# EAGLE design schematic (EAGLE 7.6.0)
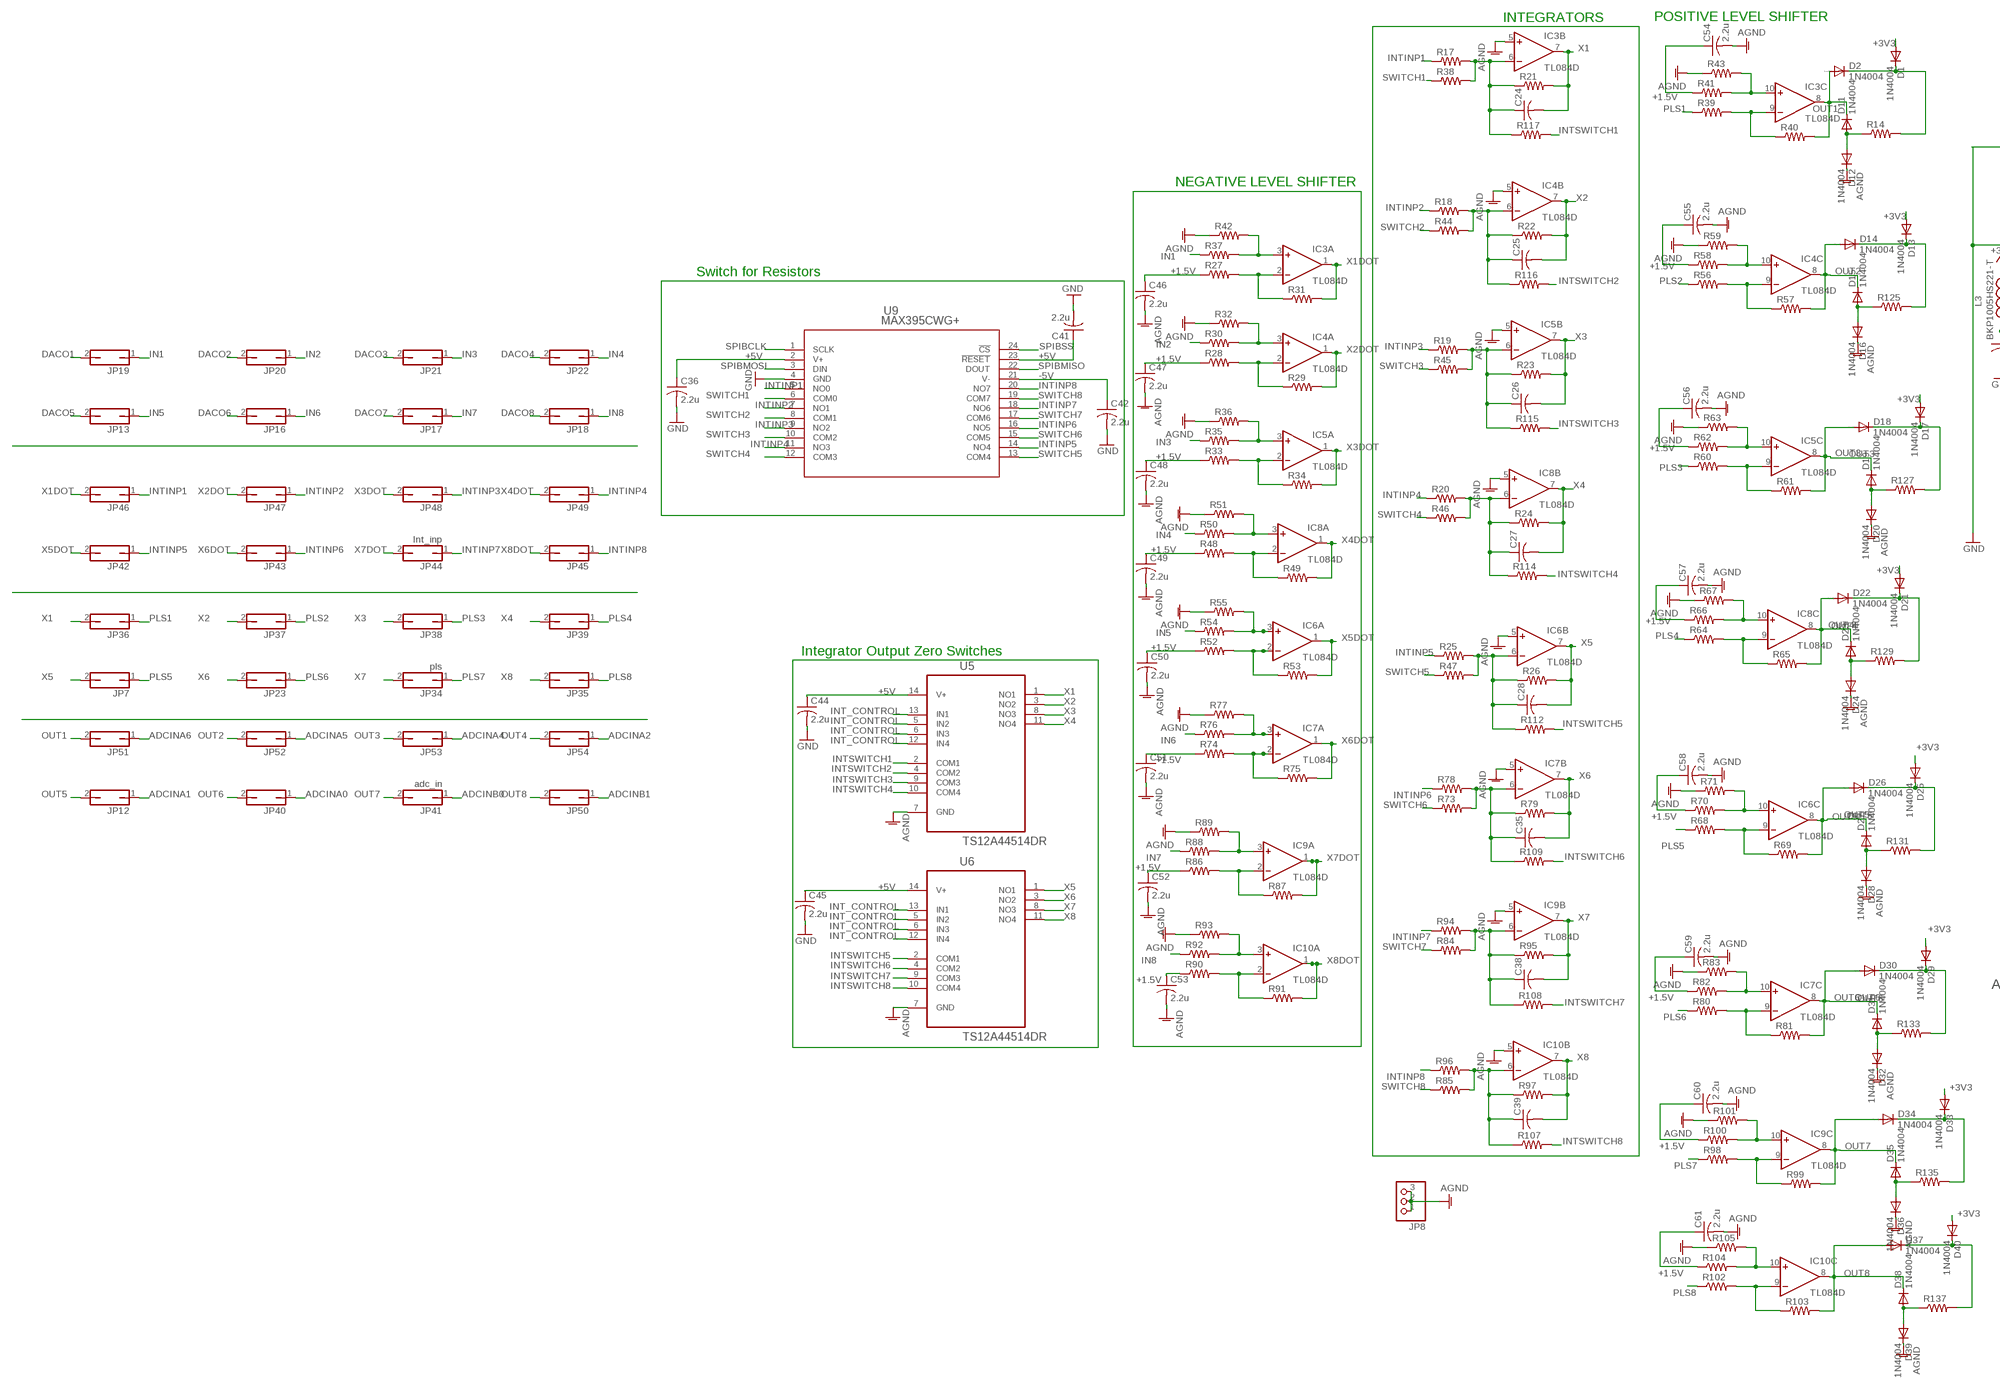
[diagram p0: schematic, sheet 1, part 1 of 2]
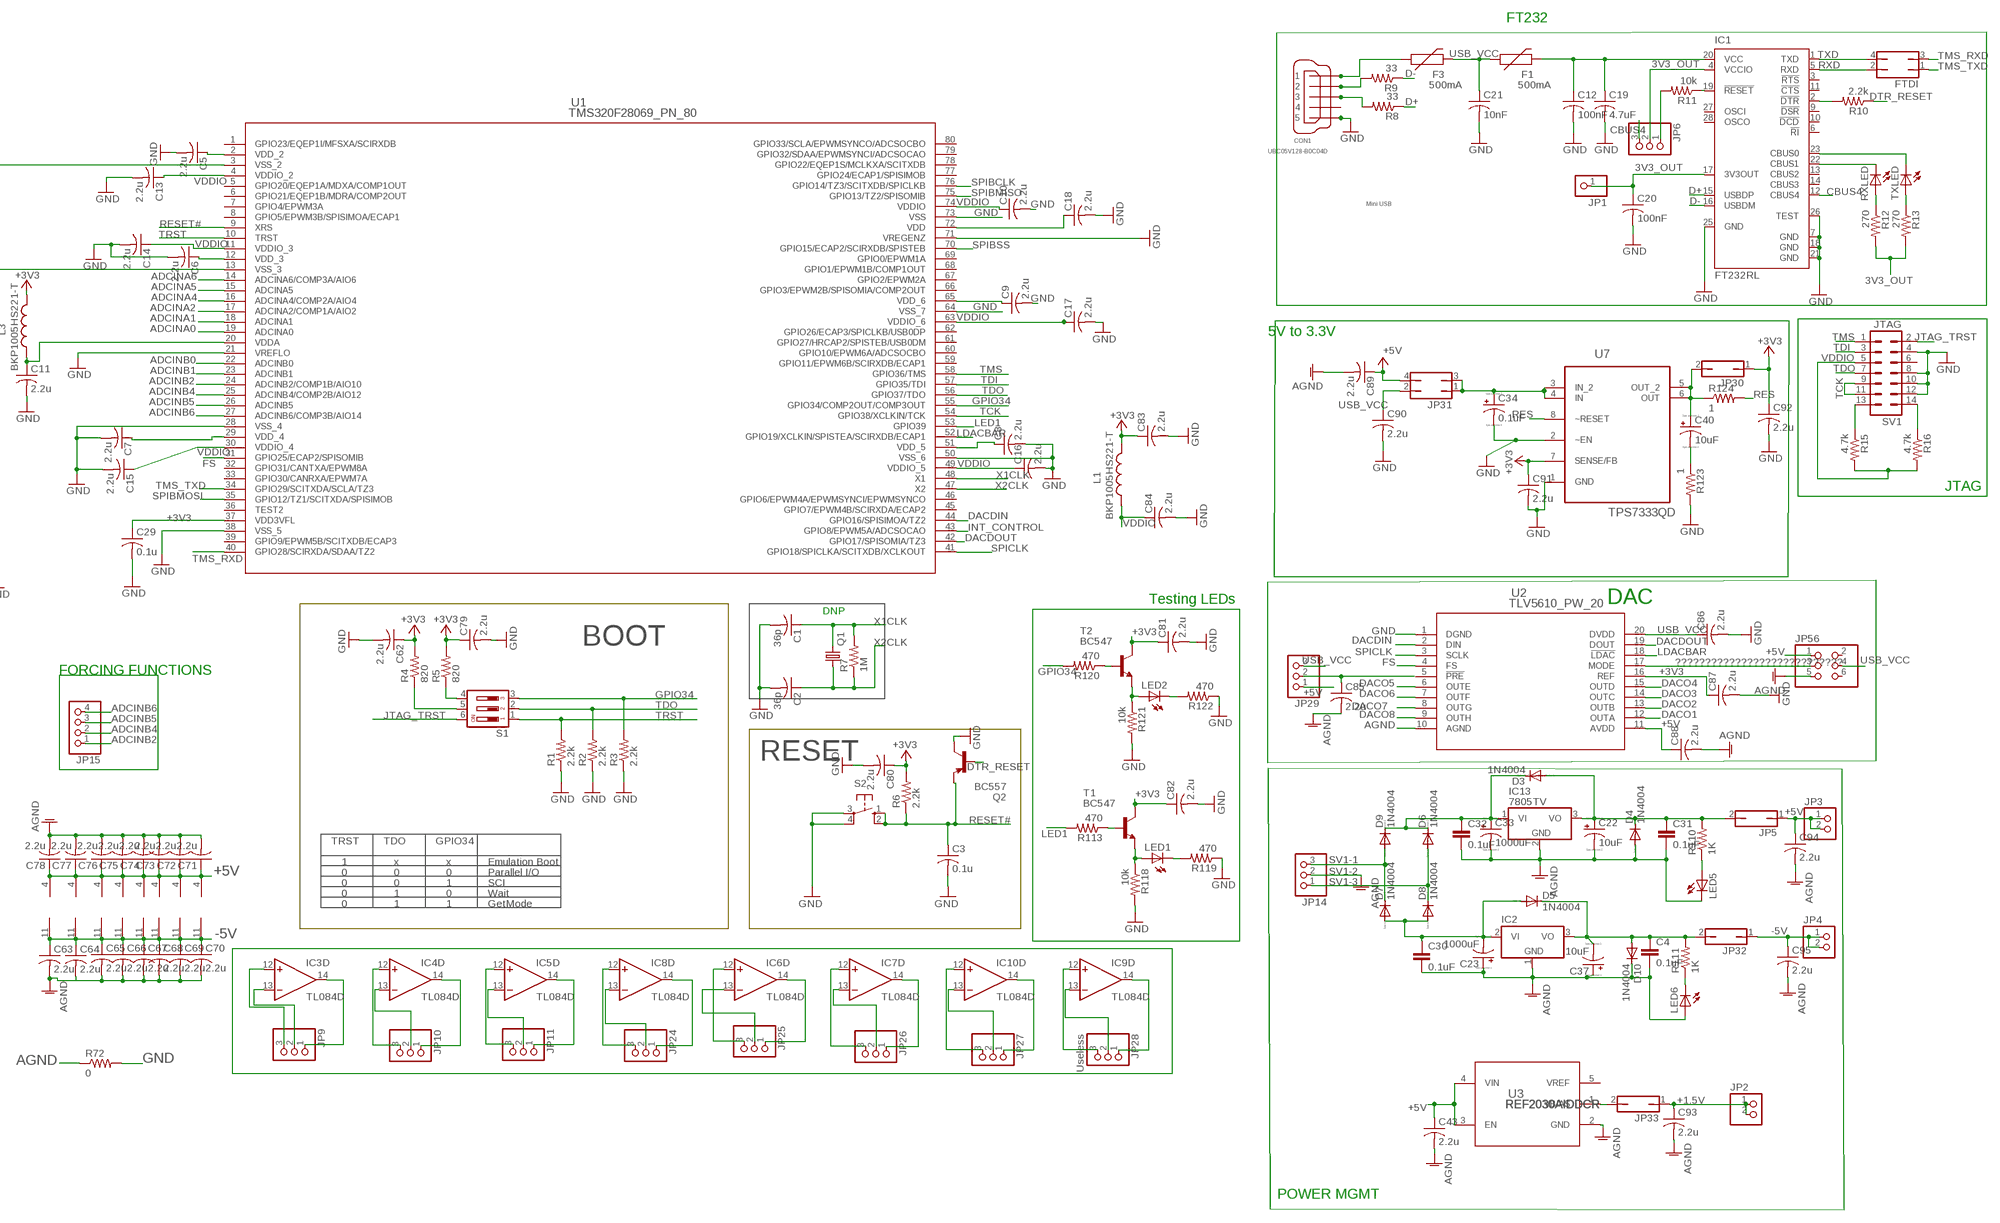
[diagram p1: schematic, sheet 1, part 2 of 2]

## Parts
C1  36p  C-USC1206  [C1206]
C2  36p  C-USC1206  [C1206]
C3  0.1u  C-USC1206  [C1206]
C4  0.1uF  C-EUC1206  [C1206]
C5  2.2u  C-USC1206  [C1206]
C6  2.2u  C-USC1206  [C1206]
C7  2.2u  C-USC1206  [C1206]
C8  2.2u  C-USC1206  [C1206]
C9  2.2u  C-USC1206  [C1206]
C10  2.2u  C-USC1206  [C1206]
C11  2.2u  C-USC1206  [C1206]
C12  100nF  C-USC1206  [C1206]
C13  2.2u  C-USC1206  [C1206]
C14  2.2u  C-USC1206  [C1206]
C15  2.2u  C-USC1206  [C1206]
C16  2.2u  C-USC1206  [C1206]
C17  2.2u  C-USC1206  [C1206]
C18  2.2u  C-USC1206  [C1206]
C19  4.7uF  C-USC1206  [C1206]
C20  100nF  C-USC1206  [C1206]
C21  10nF  C-USC1206  [C1206]
C22  10uF  CPOL-USE2.5-7  [E2,5-7]
C23  1000uF  CPOL-USE2.5-7  [E2,5-7]
C24  C-USC1206  [C1206]
C25  C-USC1206  [C1206]
C26  C-USC1206  [C1206]
C27  C-USC1206  [C1206]
C28  C-USC1206  [C1206]
C29  0.1u  C-USC1206  [C1206]
C30  0.1uF  C-EUC1206  [C1206]
C31  0.1uF  C-EUC1206  [C1206]
C32  0.1uF  C-EUC1206  [C1206]
C33  1000uF  CPOL-USE2.5-7  [E2,5-7]
C34  0.1uF  CPOL-USE2.5-7  [E2,5-7]
C35  C-USC1206  [C1206]
C36  2.2u  C-USC1206  [C1206]
C37  10uF  CPOL-USE2.5-7  [E2,5-7]
C38  C-USC1206  [C1206]
C39  C-USC1206  [C1206]
C40  10uF  CPOL-USE2.5-7  [E2,5-7]
C41  2.2u  C-USC1206  [C1206]
C42  2.2u  C-USC1206  [C1206]
C43  2.2u  C-USC1206  [C1206]
C44  2.2u  C-USC1206  [C1206]
C45  2.2u  C-USC1206  [C1206]
C46  2.2u  C-USC1206  [C1206]
C47  2.2u  C-USC1206  [C1206]
C48  2.2u  C-USC1206  [C1206]
C49  2.2u  C-USC1206  [C1206]
C50  2.2u  C-USC1206  [C1206]
C51  2.2u  C-USC1206  [C1206]
C52  2.2u  C-USC1206  [C1206]
C53  2.2u  C-USC1206  [C1206]
C54  2.2u  C-USC1206  [C1206]
C55  2.2u  C-USC1206  [C1206]
C56  2.2u  C-USC1206  [C1206]
C57  2.2u  C-USC1206  [C1206]
C58  2.2u  C-USC1206  [C1206]
C59  2.2u  C-USC1206  [C1206]
C60  2.2u  C-USC1206  [C1206]
C61  2.2u  C-USC1206  [C1206]
C62  2.2u  C-USC1206  [C1206]
C63  2.2u  C-USC1206  [C1206]
C64  2.2u  C-USC1206  [C1206]
C65  2.2u  C-USC1206  [C1206]
C66  2.2u  C-USC1206  [C1206]
C67  2.2u  C-USC1206  [C1206]
C68  2.2u  C-USC1206  [C1206]
C69  2.2u  C-USC1206  [C1206]
C70  2.2u  C-USC1206  [C1206]
C71  2.2u  C-USC1206  [C1206]
C72  2.2u  C-USC1206  [C1206]
C73  2.2u  C-USC1206  [C1206]
C74  2.2u  C-USC1206  [C1206]
C75  2.2u  C-USC1206  [C1206]
C76  2.2u  C-USC1206  [C1206]
C77  2.2u  C-USC1206  [C1206]
C78  2.2u  C-USC1206  [C1206]
C79  2.2u  C-USC1206  [C1206]
C80  2.2u  C-USC1206  [C1206]
C81  2.2u  C-USC1206  [C1206]
C82  2.2u  C-USC1206  [C1206]
C83  2.2u  C-USC1206  [C1206]
C84  2.2u  C-USC1206  [C1206]
C85  2.2u  C-USC1206  [C1206]
C86  2.2u  C-USC1206  [C1206]
C87  2.2u  C-USC1206  [C1206]
C88  2.2u  C-USC1206  [C1206]
C89  2.2u  C-USC1206  [C1206]
C90  2.2u  C-USC1206  [C1206]
C91  2.2u  C-USC1206  [C1206]
C92  2.2u  C-USC1206  [C1206]
C93  2.2u  C-USC1206  [C1206]
C94  2.2u  C-USC1206  [C1206]
C95  2.2u  C-USC1206  [C1206]
CON1  UBC05V128-B0C04D  MINI-USB-32005-201  [32005-201]
D1  1N4004  [DO41-10]
D2  1N4004  [DO41-10]
D3  1N4004  [DO41-10]
D4  1N4004  [DO41-10]
D5  1N4004  [DO41-10]
D6  1N4004  [DO41-10]
D7  1N4004  [DO41-10]
D8  1N4004  [DO41-10]
D9  1N4004  [DO41-10]
D10  1N4004  [DO41-10]
D11  1N4004  [DO41-10]
D12  1N4004  [DO41-10]
D13  1N4004  [DO41-10]
D14  1N4004  [DO41-10]
D15  1N4004  [DO41-10]
D16  1N4004  [DO41-10]
D17  1N4004  [DO41-10]
D18  1N4004  [DO41-10]
D19  1N4004  [DO41-10]
D20  1N4004  [DO41-10]
D21  1N4004  [DO41-10]
D22  1N4004  [DO41-10]
D23  1N4004  [DO41-10]
D24  1N4004  [DO41-10]
D25  1N4004  [DO41-10]
D26  1N4004  [DO41-10]
D27  1N4004  [DO41-10]
D28  1N4004  [DO41-10]
D29  1N4004  [DO41-10]
D30  1N4004  [DO41-10]
D31  1N4004  [DO41-10]
D32  1N4004  [DO41-10]
D33  1N4004  [DO41-10]
D34  1N4004  [DO41-10]
D35  1N4004  [DO41-10]
D36  1N4004  [DO41-10]
D37  1N4004  [DO41-10]
D38  1N4004  [DO41-10]
D39  1N4004  [DO41-10]
D40  1N4004  [DO41-10]
F1  500mA  PTC0603  [0603]
F3  500mA  PTC0603  [0603]
FTDI  JP2Q  [JP2Q]
IC1  FT232RL  [SSOP28]
IC2  7905T  [TO220H]
IC3  TL084D  [SO14]
IC4  TL084D  [SO14]
IC5  TL084D  [SO14]
IC6  TL084D  [SO14]
IC7  TL084D  [SO14]
IC8  TL084D  [SO14]
IC9  TL084D  [SO14]
IC10  TL084D  [SO14]
IC13  7805TV  [TO220V]
JP1  PINHD-1X1  [1X01]
JP2  PINHD-1X2  [1X02]
JP3  PINHD-1X2  [1X02]
JP4  PINHD-1X2  [1X02]
JP5  JP1Q  [JP1]
JP6  PINHD-1X3  [1X03]
JP7  JP1Q  [JP1]
JP8  PINHD-1X3  [1X03]
JP9  PINHD-1X3  [1X03]
JP10  PINHD-1X3  [1X03]
JP11  PINHD-1X3  [1X03]
JP12  JP1Q  [JP1]
JP13  JP1Q  [JP1]
JP14  PINHD-1X3  [1X03]
JP15  PINHD-1X4  [1X04]
JP16  JP1Q  [JP1]
JP17  JP1Q  [JP1]
JP18  JP1Q  [JP1]
JP19  JP1Q  [JP1]
JP20  JP1Q  [JP1]
JP21  JP1Q  [JP1]
JP22  JP1Q  [JP1]
JP23  JP1Q  [JP1]
JP24  PINHD-1X3  [1X03]
JP25  PINHD-1X3  [1X03]
JP26  PINHD-1X3  [1X03]
JP27  PINHD-1X3  [1X03]
JP28  Useless  PINHD-1X3  [1X03]
JP29  PINHD-1X3  [1X03]
JP30  JP1Q  [JP1]
JP31  JP2Q  [JP2Q]
JP32  JP1Q  [JP1]
JP33  JP1Q  [JP1]
JP34  pls  JP1Q  [JP1]
JP35  JP1Q  [JP1]
JP36  JP1Q  [JP1]
JP37  JP1Q  [JP1]
JP38  JP1Q  [JP1]
JP39  JP1Q  [JP1]
JP40  JP1Q  [JP1]
JP41  adc_in  JP1Q  [JP1]
JP42  JP1Q  [JP1]
JP43  JP1Q  [JP1]
JP44  Int_inp  JP1Q  [JP1]
JP45  JP1Q  [JP1]
JP46  JP1Q  [JP1]
JP47  JP1Q  [JP1]
JP48  JP1Q  [JP1]
JP49  JP1Q  [JP1]
JP50  JP1Q  [JP1]
JP51  JP1Q  [JP1]
JP52  JP1Q  [JP1]
JP53  JP1Q  [JP1]
JP54  JP1Q  [JP1]
JP56  PINHD-2X3  [2X03]
L1  BKP1005HS221-T  L-US0204/5  [0204/5]
L3  BKP1005HS221-T  L-US0204/5  [0204/5]
LED1  LED3MM  [LED3MM]
LED2  LED3MM  [LED3MM]
LED5  LED3MM  [LED3MM]
LED6  LED3MM  [LED3MM]
Q1  CRYSTALHC49S  [HC49/S]
Q2  BC557  [TO92-EBC]
R1  2.2k  R-US_R1206  [R1206]
R2  2.2k  R-US_R1206  [R1206]
R3  2.2k  R-US_R1206  [R1206]
R4  820  R-US_R1206  [R1206]
R5  820  R-US_R1206  [R1206]
R6  2.2k  R-US_R1206  [R1206]
R7  1M  R-US_R1206  [R1206]
R8  33  R-US_R1206  [R1206]
R9  33  R-US_R1206  [R1206]
R10  2.2k  R-US_R1206  [R1206]
R11  10k  R-US_R1206  [R1206]
R12  270  R-US_R1206  [R1206]
R13  270  R-US_R1206  [R1206]
R14  R-US_R1206  [R1206]
R15  4.7k  R-US_M1206  [M1206]
R16  4.7k  R-US_M1206  [M1206]
R17  R-US_R1206  [R1206]
R18  R-US_R1206  [R1206]
R19  R-US_R1206  [R1206]
R20  R-US_R1206  [R1206]
R21  R-US_R1206  [R1206]
R22  R-US_R1206  [R1206]
R23  R-US_R1206  [R1206]
R24  R-US_R1206  [R1206]
R25  R-US_R1206  [R1206]
R26  R-US_R1206  [R1206]
R27  R-US_R1206  [R1206]
R28  R-US_R1206  [R1206]
R29  R-US_R1206  [R1206]
R30  R-US_R1206  [R1206]
R31  R-US_R1206  [R1206]
R32  R-US_R1206  [R1206]
R33  R-US_R1206  [R1206]
R34  R-US_R1206  [R1206]
R35  R-US_R1206  [R1206]
R36  R-US_R1206  [R1206]
R37  R-US_R1206  [R1206]
R38  R-US_R1206  [R1206]
R39  R-US_R1206  [R1206]
R40  R-US_R1206  [R1206]
R41  R-US_R1206  [R1206]
R42  R-US_R1206  [R1206]
R43  R-US_R1206  [R1206]
R44  R-US_R1206  [R1206]
R45  R-US_R1206  [R1206]
R46  R-US_R1206  [R1206]
R47  R-US_R1206  [R1206]
R48  R-US_R1206  [R1206]
R49  R-US_R1206  [R1206]
R50  R-US_R1206  [R1206]
R51  R-US_R1206  [R1206]
R52  R-US_R1206  [R1206]
R53  R-US_R1206  [R1206]
R54  R-US_R1206  [R1206]
R55  R-US_R1206  [R1206]
R56  R-US_R1206  [R1206]
R57  R-US_R1206  [R1206]
R58  R-US_R1206  [R1206]
R59  R-US_R1206  [R1206]
R60  R-US_R1206  [R1206]
R61  R-US_R1206  [R1206]
R62  R-US_R1206  [R1206]
R63  R-US_R1206  [R1206]
R64  R-US_R1206  [R1206]
R65  R-US_R1206  [R1206]
R66  R-US_R1206  [R1206]
R67  R-US_R1206  [R1206]
R68  R-US_R1206  [R1206]
R69  R-US_R1206  [R1206]
R70  R-US_R1206  [R1206]
R71  R-US_R1206  [R1206]
R72  0  R-US_R1206  [R1206]
R73  R-US_R1206  [R1206]
R74  R-US_R1206  [R1206]
R75  R-US_R1206  [R1206]
R76  R-US_R1206  [R1206]
R77  R-US_R1206  [R1206]
R78  R-US_R1206  [R1206]
R79  R-US_R1206  [R1206]
R80  R-US_R1206  [R1206]
R81  R-US_R1206  [R1206]
R82  R-US_R1206  [R1206]
R83  R-US_R1206  [R1206]
R84  R-US_R1206  [R1206]
R85  R-US_R1206  [R1206]
R86  R-US_R1206  [R1206]
R87  R-US_R1206  [R1206]
R88  R-US_R1206  [R1206]
R89  R-US_R1206  [R1206]
R90  R-US_R1206  [R1206]
R91  R-US_R1206  [R1206]
R92  R-US_R1206  [R1206]
R93  R-US_R1206  [R1206]
R94  R-US_R1206  [R1206]
R95  R-US_R1206  [R1206]
R96  R-US_R1206  [R1206]
R97  R-US_R1206  [R1206]
R98  R-US_R1206  [R1206]
R99  R-US_R1206  [R1206]
R100  R-US_R1206  [R1206]
R101  R-US_R1206  [R1206]
R102  R-US_R1206  [R1206]
R103  R-US_R1206  [R1206]
R104  R-US_R1206  [R1206]
R105  R-US_R1206  [R1206]
R107  R-US_R1206  [R1206]
R108  R-US_R1206  [R1206]
R109  R-US_R1206  [R1206]
R110  1K  R-US_0207/10  [0207/10]
R111  1K  R-US_0207/10  [0207/10]
R112  R-US_R1206  [R1206]
R113  470  R-US_R1206  [R1206]
R114  R-US_R1206  [R1206]
R115  R-US_R1206  [R1206]
R116  R-US_R1206  [R1206]
R117  R-US_R1206  [R1206]
R118  10k  R-US_R1206  [R1206]
R119  470  R-US_R1206  [R1206]
R120  470  R-US_R1206  [R1206]
R121  10k  R-US_R1206  [R1206]
R122  470  R-US_R1206  [R1206]
R123  1  R-US_M1206  [M1206]
R124  1  R-US_M1206  [M1206]
R125  R-US_R1206  [R1206]
R127  R-US_R1206  [R1206]
R129  R-US_R1206  [R1206]
R131  R-US_R1206  [R1206]
R133  R-US_R1206  [R1206]
R135  R-US_R1206  [R1206]
R137  R-US_R1206  [R1206]
RXLED  LEDCHIPLED_1206  [CHIPLED_1206]
S1  DIP03YL  [DIP03YL]
S2  10-XX  [B3F-10XX]
SV1  JTAG  MA07-2  [MA07-2]
T1  BC547  [TO92]
T2  BC547  [TO92]
TXLED  LEDCHIPLED_1206  [CHIPLED_1206]
U1  TMS320F28069_PN_80  [PN80]
U2  TLV5610_PW_20  [PW20]
U3  REF2030AIDDCR  [DDC0005A_N]
U5  TS12A44514DR  [SOIC127P600X175-14N]
U6  TS12A44514DR  [SOIC127P600X175-14N]
U7  TPS7333QD  [SOIC127P600X175-8N]
U9  MAX395CWG+  [21-0042B_24]

## Nets
3V3_OUT: C20.1 IC1.4(VCCIO) IC1.17(3V3OUT) JP1.1 JP6.2 R12.2 R13.2
+1.5V: C46.1 C47.1 C48.1 C49.1 C50.1 C51.1 C52.1 C53.1 C54.1 C55.1 C56.1 C57.1 C58.1 C59.1 C60.1 C61.1 C93.1 JP2.1 JP2.2 JP33.1 R27.1 R28.1 R33.1 R41.1 R48.1 R52.1 R58.1 R62.1 R66.1 R70.1 R74.1 R82.1 R86.1 R90.1 R100.1 R104.1
+3V3: C29.1 C62.1 C79.1 C80.1 C81.1 C82.1 C83.1 C87.1 C91.1 C92.1 D1.A D13.A D17.A D21.A D25.A D29.A D33.A D40.A JP30.1 L1.2 L3.2 R4.2 R5.2 R6.2 T1.3(C) T2.3(C) U1.37(VDD3VFL) U2.16(REF) U7.7(SENSE/FB)
+5V: C36.1 C41.1 C43.1 C44.1 C45.1 C71.1 C72.1 C73.1 C74.1 C75.1 C76.1 C77.1 C78.1 C88.1 C89.1 C94.1 IC3.4(P:V+) IC4.4(P:V+) IC5.4(P:V+) IC6.4(P:V+) IC7.4(P:V+) IC8.4(P:V+) IC9.4(P:V+) IC10.4(P:V+) JP3.1 JP3.2 JP5.1 JP29.1 JP31.4 JP56.1 U2.11(AVDD) U3.3(EN) U3.4(VIN) U5.14(V+) U6.14(V+) U9.2(V+) U9.23(!RESET) ; supply symbol labelled +3V3
-5V: C42.1 C63.1 C64.1 C65.1 C66.1 C67.1 C68.1 C69.1 C70.1 C95.1 IC3.11(P:V-) IC4.11(P:V-) IC5.11(P:V-) IC6.11(P:V-) IC7.11(P:V-) IC8.11(P:V-) IC9.11(P:V-) IC10.11(P:V-) JP4.1 JP4.2 JP32.1 U9.21(V-)
????????????????????????????: JP56.3 U2.17(MODE)
ADCINA0: JP40.1 U1.19(ADCINA0)
ADCINA1: JP12.1 U1.18(ADCINA1)
ADCINA2: JP54.1 U1.17(ADCINA2/COMP1A/AIO2)
ADCINA4: JP53.1 U1.16(ADCINA4/COMP2A/AIO4)
ADCINA5: JP52.1 U1.15(ADCINA5)
ADCINA6: JP51.1 U1.14(ADCINA6/COMP3A/AIO6)
ADCINB0: JP41.1 U1.22(ADCINB0)
ADCINB1: JP50.1 U1.23(ADCINB1)
ADCINB2: JP15.1 U1.24(ADCINB2/COMP1B/AIO10)
ADCINB4: JP15.2 U1.25(ADCINB4/COMP2B/AIO12)
ADCINB5: JP15.3 U1.26(ADCINB5)
ADCINB6: JP15.4 U1.27(ADCINB6/COMP3B/AIO14)
AGND: C4.2 C22.- C23.+ C30.2 C31.2 C32.2 C33.- C37.+ C43.2 C46.2 C47.2 C48.2 C49.2 C50.2 C51.2 C52.2 C53.2 C54.2 C55.2 C56.2 C57.2 C58.2 C59.2 C60.2 C61.2 C63.2 C64.2 C65.2 C66.2 C67.2 C68.2 C69.2 C70.2 C71.2 C72.2 C73.2 C74.2 C75.2 C76.2 C77.2 C78.2 C85.2 C88.2 C89.2 C93.2 C94.2 C95.2 D4.A D10.C D12.C D16.C D20.C D24.C D28.C D32.C D36.C D39.C IC2.1(GND) IC3.5(B:+IN) IC4.5(B:+IN) IC5.5(B:+IN) IC6.5(B:+IN) IC7.5(B:+IN) IC8.5(B:+IN) IC9.5(B:+IN) IC10.5(B:+IN) IC13.2(GND) JP8.1 JP8.2 JP8.3 JP56.5 LED5.K(C) LED6.A R32.1 R36.1 R42.1 R43.1 R51.1 R55.1 R59.1 R63.1 R67.1 R71.1 R72.1 R77.1 R83.1 R89.1 R93.1 R101.1 R105.1 U2.10(AGND) U3.2(GND) U5.7(GND) U6.7(GND)
CBUS4: IC1.12(CBUS4) JP6.3
D+: IC1.15(USBDP) R8.1
D-: IC1.16(USBDM) R9.1
DACDIN: U1.44(GPIO16/SPISIMOA/TZ2) U2.2(DIN)
DACDOUT: U1.42(GPIO17/SPISOMIA/TZ3) U2.19(DOUT)
DACO1: JP19.2 U2.12(OUTA)
DACO2: JP20.2 U2.13(OUTB)
DACO3: JP21.2 U2.14(OUTC)
DACO4: JP22.2 U2.15(OUTD)
DACO5: JP13.2 U2.6(OUTE)
DACO6: JP16.2 U2.7(OUTF)
DACO7: JP17.2 U2.8(OUTG)
DACO8: JP18.2 U2.9(OUTH)
DTR_RESET: Q2.B R10.1
FS: U1.31(GPIO25/ECAP2/SPISOMIB) U2.4(FS)
GND: C1.2 C2.2 C3.2 C5.2 C6.2 C7.2 C8.2 C9.2 C10.2 C11.2 C12.2 C13.2 C14.2 C15.2 C16.2 C17.2 C18.2 C19.2 C20.2 C21.2 C29.2 C34.- C36.2 C41.2 C42.2 C44.2 C45.2 C62.2 C79.2 C80.2 C81.2 C82.2 C83.2 C84.2 C86.2 C87.2 C90.2 C91.2 C92.2 CON1.5 IC1.7(GND) IC1.18(GND) IC1.21(GND) IC1.25(GND) IC1.26(TEST) Q2.C R1.1 R2.1 R3.1 R72.2 R118.2 R119.1 R121.2 R122.1 R123.2 S2.3(P) S2.4(P1) SV1.4 SV1.8 SV1.10 SV1.12 U1.3(VSS_2) U1.13(VSS_3) U1.21(VREFLO) U1.28(VSS_4) U1.38(VSS_5) U1.50(VSS_6) U1.64(VSS_7) U1.71(VREGENZ) U1.73(VSS) U2.1(DGND) U7.1(GND) U7.2(~EN) U9.4(GND)
GPIO34: R3.2 R120.2 S1.3 U1.55(GPIO34/COMP2OUT/COMP3OUT)
IDK: C22.+ C31.1 D3.A D4.C IC13.3(VO) JP5.2 R110.2
IDK2: C4.1 C37.- D5.C D10.A IC2.3(VO) JP32.2 R111.2
IN1: JP19.1 R37.1
IN2: JP20.1 R30.1
IN3: JP21.1 R35.1
IN4: JP22.1 R50.1
IN5: JP13.1 R54.1
IN6: JP16.1 R76.1
IN7: JP17.1 R88.1
IN8: JP18.1 R92.1
INT_CONTROL: U1.43(GPIO8/EPWM5A/ADCSOCAO) U5.5(IN2) U5.6(IN3) U5.12(IN4) U5.13(IN1) U6.5(IN2) U6.6(IN3) U6.12(IN4) U6.13(IN1)
INTINP1: JP46.1 R17.1 U9.5(NO0)
INTINP2: JP47.1 R18.1 U9.7(NO1)
INTINP3: JP48.1 R19.1 U9.9(NO2)
INTINP4: JP49.1 R20.1 U9.11(NO3)
INTINP5: JP42.1 R25.1 U9.14(NO4)
INTINP6: JP43.1 R78.1 U9.16(NO5)
INTINP7: JP44.1 R94.1 U9.18(NO6)
INTINP8: JP45.1 R96.1 U9.20(NO7)
INTSWITCH1: R117.2 U5.2(COM1)
INTSWITCH2: R116.2 U5.4(COM2)
INTSWITCH3: R115.2 U5.9(COM3)
INTSWITCH4: R114.2 U5.10(COM4)
INTSWITCH5: R112.2 U6.2(COM1)
INTSWITCH6: R109.2 U6.4(COM2)
INTSWITCH7: R108.2 U6.9(COM3)
INTSWITCH8: R107.2 U6.10(COM4)
JTAG_TRST: S1.6 SV1.2
LDACBAR: U1.52(GPIO19/XCLKIN/SPISTEA/SCIRXDB/ECAP1) U2.18(!LDAC)
LED1: R113.2 U1.53(GPIO39)
N$1: C5.1 U1.2(VDD_2)
N$2: C6.1 U1.12(VDD_3)
N$3: C7.1 U1.29(VDD_4)
N$4: C8.1 U1.51(VDD_5)
N$5: C9.1 U1.65(VDD_6)
N$6: IC1.2(!DTR) R10.2
N$7: C11.1 L3.1 U1.20(VDDA)
N$8: C18.1 U1.72(VDD)
N$9: R5.1 S1.4
N$10: R4.1 S1.5
N$11: CON1.2 R9.2
N$12: CON1.3 R8.2
N$13: IC1.19(!RESET) R11.1
N$14: IC1.22(CBUS1) RXLED.C
N$15: IC1.23(CBUS0) TXLED.C
N$16: R12.1 RXLED.A
N$17: R13.1 TXLED.A
N$20: C25.1 IC4.6(B:-IN) R18.2 R22.1 R44.2 R116.1
N$21: C26.1 IC5.6(B:-IN) R19.2 R23.1 R45.2 R115.1
N$22: C27.1 IC8.6(B:-IN) R20.2 R24.1 R46.2 R114.1
N$23: IC4.2(A:-IN) R28.2 R29.1
N$24: R15.1 SV1.13
N$25: R16.1 SV1.14
N$26: IC4.3(A:+IN) R30.2 R32.2
N$28: C24.1 IC3.6(B:-IN) R17.2 R21.1 R38.2 R117.1
N$29: IC3.2(A:-IN) R27.2 R31.1
N$30: C28.1 IC6.6(B:-IN) R25.2 R26.1 R47.2 R112.1
N$31: IC5.2(A:-IN) R33.2 R34.1
N$33: IC3.3(A:+IN) R37.2 R42.2
N$35: IC5.3(A:+IN) R35.2 R36.2
N$36: IC3.9(C:-IN) R39.2 R40.1
N$38: IC3.10(C:+IN) R41.2 R43.2
N$39: IC8.2(A:-IN) R48.2 R49.1
N$40: IC8.3(A:+IN) R50.2 R51.2
N$41: IC7.2(A:-IN) R74.2 R75.1
N$42: IC6.2(A:-IN) R52.2 R53.1
N$43: D19.A D20.A R127.1
N$44: IC6.3(A:+IN) R54.2 R55.2
N$45: IC7.3(A:+IN) R76.2 R77.2
N$46: IC8.12(D:+IN) JP24.3
N$47: IC4.9(C:-IN) R56.2 R57.1
N$48: IC4.10(C:+IN) R58.2 R59.2
N$49: IC5.9(C:-IN) R60.2 R61.1
N$50: IC5.10(C:+IN) R62.2 R63.2
N$51: IC8.9(C:-IN) R64.2 R65.1
N$52: IC8.10(C:+IN) R66.2 R67.2
N$53: IC6.9(C:-IN) R68.2 R69.1
N$54: IC6.10(C:+IN) R70.2 R71.2
N$55: C35.1 IC7.6(B:-IN) R73.2 R78.2 R79.1 R109.1
N$56: IC7.9(C:-IN) R80.2 R81.1
N$57: IC7.10(C:+IN) R82.2 R83.2
N$58: IC9.2(A:-IN) R86.2 R87.1
N$59: IC9.3(A:+IN) R88.2 R89.2
N$60: IC10.2(A:-IN) R90.2 R91.1
N$61: IC10.3(A:+IN) R92.2 R93.2
N$62: C38.1 IC9.6(B:-IN) R84.2 R94.2 R95.1 R108.1
N$63: C39.1 IC10.6(B:-IN) R85.2 R96.2 R97.1 R107.1
N$64: IC9.9(C:-IN) R98.2 R99.1
N$65: IC9.10(C:+IN) R100.2 R101.2
N$66: IC10.9(C:-IN) R102.2 R103.1
N$67: IC10.10(C:+IN) R104.2 R105.2
N$70: IC8.13(D:-IN) JP24.2
N$71: IC10.12(D:+IN) JP27.3
N$72: IC7.14(D:OUT) JP26.1
N$73: C32.1 C33.+ D3.C D6.C D9.C IC13.1(VI)
N$74: IC7.12(D:+IN) JP26.3
N$75: IC10.14(D:OUT) JP27.1
N$76: IC9.12(D:+IN) JP28.3
N$77: C40.+ JP30.2 R124.1 U7.5(OUT_2) U7.6(OUT)
N$78: C40.- R123.1
N$80: LED6.K(C) R111.1
N$81: C34.+ JP31.1 JP31.3 U7.3(IN_2) U7.4(IN)
N$82: LED5.A R110.1
N$83: CON1.1 F3.1
N$85: IC8.14(D:OUT) JP24.1
N$86: C23.- C30.1 D5.A D7.A D8.A IC2.2(VI)
N$87: IC6.13(D:-IN) JP25.2
N$88: IC6.12(D:+IN) JP25.3
N$89: IC6.14(D:OUT) JP25.1
N$90: IC7.13(D:-IN) JP26.2
N$91: JP33.2 U3.1(VBIAS)
N$93: IC10.13(D:-IN) JP27.2
N$95: JP6.1 R11.2
N$96: IC9.13(D:-IN) JP28.2
N$97: D11.A D12.A R14.1
N$98: IC9.14(D:OUT) JP28.1
N$100: D15.A D16.A R125.1
N$102: R113.1 T1.2(B)
N$104: LED1.A R118.1 T1.1(E)
N$105: LED1.K(C) R119.2
N$106: R120.1 T2.2(B)
N$107: LED2.A R121.1 T2.1(E)
N$108: LED2.K(C) R122.2
N$109: IC3.13(D:-IN) JP9.2
N$110: IC3.12(D:+IN) JP9.3
N$111: IC3.14(D:OUT) JP9.1
N$112: IC4.13(D:-IN) JP10.2
N$113: IC4.12(D:+IN) JP10.3
N$114: IC4.14(D:OUT) JP10.1
N$115: IC5.12(D:+IN) JP11.3
N$116: IC5.13(D:-IN) JP11.2
N$117: IC5.14(D:OUT) JP11.1
N$118: D1.C D2.C R14.2
N$119: D13.C D14.C R125.2
N$120: D17.C D18.C R127.2
N$121: D23.A D24.A R129.1
N$122: D21.C D22.C R129.2
N$123: D27.A D28.A R131.1
N$124: D25.C D26.C R131.2
N$125: D31.A D32.A R133.1
N$126: D29.C D30.C R133.2
N$127: D35.A D36.A R135.1
N$128: D33.C D34.C R135.2
N$129: D38.A D39.A R137.1
N$130: D37.C R137.2
N$133: C85.1 JP29.2
OUT1: D2.A D11.C IC3.8(C:OUT) JP51.2 R40.2
OUT2: D14.A D15.C IC4.8(C:OUT) JP52.2 R57.2
OUT3: D18.A D19.C IC5.8(C:OUT) JP53.2 R61.2
OUT4: D22.A D23.C IC8.8(C:OUT) JP54.2 R65.2
OUT5: D26.A D27.C IC6.8(C:OUT) JP12.2 R69.2
OUT6: D30.A D31.C IC7.8(C:OUT) JP40.2 R81.2
OUT7: D34.A D35.C IC9.8(C:OUT) JP41.2 R99.2
OUT8: D37.A D38.C IC10.8(C:OUT) JP50.2 R103.2
PLS1: JP36.1 R39.1
PLS2: JP37.1 R56.1
PLS3: JP38.1 R60.1
PLS4: JP39.1 R64.1
PLS5: JP7.1 R68.1
PLS6: JP23.1 R80.1
PLS7: JP34.1 R98.1
PLS8: JP35.1 R102.1
RES: R124.2 U7.8(~RESET)
RESET#: C3.1 Q2.E R6.1 S2.1(S) S2.2(S1) U1.9(XRS)
RXD: FTDI.2 IC1.5(RXD)
SPIBCLK: U1.76(GPIO14/TZ3/SCITXDB/SPICLKB) U9.1(SCLK)
SPIBMISO: U1.75(GPIO13/TZ2/SPISOMIB) U9.22(DOUT)
SPIBMOSI: U1.35(GPIO12/TZ1/SCITXDA/SPISIMOB) U9.3(DIN)
SPIBSS: U1.70(GPIO15/ECAP2/SCIRXDB/SPISTEB) U9.24(!CS)
SPICLK: U1.41(GPIO18/SPICLKA/SCITXDB/XCLKOUT) U2.3(SCLK)
SV1-1: D7.C D9.A JP14.3
SV1-2: JP14.2 ; supply symbol labelled AGND
SV1-3: D6.A D8.C JP14.1
SWITCH1: R38.1 U9.6(COM0)
SWITCH2: R44.1 U9.8(COM1)
SWITCH3: R45.1 U9.10(COM2)
SWITCH4: R46.1 U9.12(COM3)
SWITCH5: R47.1 U9.13(COM4)
SWITCH6: R73.1 U9.15(COM5)
SWITCH7: R84.1 U9.17(COM6)
SWITCH8: R85.1 U9.19(COM7)
TCK: SV1.9 SV1.11 U1.54(GPIO38/XCLKIN/TCK)
TDI: SV1.3 U1.57(GPIO35/TDI)
TDO: R2.2 S1.2 SV1.7 U1.56(GPIO37/TDO)
TMS: SV1.1 U1.58(GPIO36/TMS)
TMS_RXD: FTDI.3 U1.40(GPIO28/SCIRXDA/SDAA/TZ2)
TMS_TXD: FTDI.1 U1.34(GPIO29/SCITXDA/SCLA/TZ3)
TRST: R1.2 S1.1 U1.10(TRST)
TXD: FTDI.4 IC1.1(TXD)
USB_VCC: C21.1 C86.1 C90.1 F1.1 F3.2 JP29.3 JP31.2 JP56.4 U2.20(DVDD)
VCC [power]: C12.1 C19.1 F1.2 IC1.20(VCC)
VDDIO: C10.1 C13.1 C14.1 C15.1 C16.1 C17.1 C84.1 L1.1 R15.2 R16.2 SV1.5 U1.4(VDDIO_2) U1.11(VDDIO_3) U1.30(VDDIO_4) U1.49(VDDIO_5) U1.63(VDDIO_6) U1.74(VDDIO)
X1: C24.2 IC3.7(B:OUT) JP36.2 R21.2 U5.1(NO1)
X1CLK: C1.1 Q1.2 R7.2 U1.48(X1)
X1DOT: IC3.1(A:OUT) JP46.2 R31.2
X2: C25.2 IC4.7(B:OUT) JP37.2 R22.2 U5.3(NO2)
X2CLK: C2.1 Q1.1 R7.1 U1.47(X2)
X2DOT: IC4.1(A:OUT) JP47.2 R29.2
X3: C26.2 IC5.7(B:OUT) JP38.2 R23.2 U5.8(NO3)
X3DOT: IC5.1(A:OUT) JP48.2 R34.2
X4: C27.2 IC8.7(B:OUT) JP39.2 R24.2 U5.11(NO4)
X4DOT: IC8.1(A:OUT) JP49.2 R49.2
X5: C28.2 IC6.7(B:OUT) JP7.2 R26.2 U6.1(NO1)
X5DOT: IC6.1(A:OUT) JP42.2 R53.2
X6: C35.2 IC7.7(B:OUT) JP23.2 R79.2 U6.3(NO2)
X6DOT: IC7.1(A:OUT) JP43.2 R75.2
X7: C38.2 IC9.7(B:OUT) JP34.2 R95.2 U6.8(NO3)
X7DOT: IC9.1(A:OUT) JP44.2 R87.2
X8: C39.2 IC10.7(B:OUT) JP35.2 R97.2 U6.11(NO4)
X8DOT: IC10.1(A:OUT) JP45.2 R91.2
Unconnected: CON1.4 D40.C IC1.3(!RTS) IC1.6(!RI) IC1.9(!DSR) IC1.10(!DCD) IC1.11(!CTS) IC1.13(CBUS2) IC1.14(CBUS3) IC1.27(OSCI) IC1.28(OSCO) JP56.2 JP56.6 SV1.6 U1.1(GPIO23/EQEP1I/MFSXA/SCIRXDB) U1.5(GPIO20/EQEP1A/MDXA/COMP1OUT) U1.6(GPIO21/EQEP1B/MDRA/COMP2OUT) U1.7(GPIO4/EPWM3A) U1.8(GPIO5/EPWM3B/SPISIMOA/ECAP1) U1.32(GPIO31/CANTXA/EPWM8A) U1.33(GPIO30/CANRXA/EPWM7A) U1.36(TEST2) U1.39(GPIO9/EPWM5B/SCITXDB/ECAP3) U1.45(GPIO7/EPWM4B/SCIRXDA/ECAP2) U1.46(GPIO6/EPWM4A/EPWMSYNCI/EPWMSYNCO) U1.59(GPIO11/EPWM6B/SCIRXDB/ECAP1) U1.60(GPIO10/EPWM6A/ADCSOCBO) U1.61(GPIO27/HRCAP2/SPISTEB/USB0DM) U1.62(GPIO26/ECAP3/SPICLKB/USB0DP) U1.66(GPIO3/EPWM2B/SPISOMIA/COMP2OUT) U1.67(GPIO2/EPWM2A) U1.68(GPIO1/EPWM1B/COMP1OUT) U1.69(GPIO0/EPWM1A) U1.77(GPIO24/ECAP1/SPISIMOB) U1.78(GPIO22/EQEP1S/MCLKXA/SCITXDB) U1.79(GPIO32/SDAA/EPWMSYNCI/ADCSOCAO) U1.80(GPIO33/SCLA/EPWMSYNCO/ADCSOCBO) U2.5(!PRE) U3.5(VREF)

## Notes on the sheet
- FT232
- INTEGRATORS | POSITIVE LEVEL SHIFTER
- NEGATIVE LEVEL SHIFTER | Mini USB
- Switch for Resistors
- 5V to 3.3V
- JTAG
- Testing LEDs | DAC
- DNP
- BOOT
- FORCING FUNCTIONS
- Integrator Output Zero Switches
- RESET
- TRST | TDO | GPIO34
- 1 | x | x | Emulation Boot
- 0 | 0 | 0 | Parallel I/O
- 0 | 0 | 1 | SCI
- 0 | 1 | 0 | Wait
- 0 | 1 | 1 | GetMode
- POWER MGMT

## Library data of the parts
C1-C3 C5-C21 C29 C36 C41-C95 = resistor:C-US: CAPACITOR, American symbol
C4 C30-C32 = rcl:C-EU: CAPACITOR, European symbol
C22 C23 C33 C34 C37 C40 = resistor:CPOL-US: POLARIZED CAPACITOR, American symbol
C24-C28 C35 C38 C39 = rcl:C-US: CAPACITOR, American symbol
CON1 = con-cypressindustries:MINI-USB-: MINI USB-B Conector Source: www.cypressindustries.com; OC_FARNELL: unknown; OC_NEWARK: unknown
D1-D40 = diode:1N4004: DIODE general purpose rectifier, 1 A
F1 F3 = SparkFun:PTC: Resettable Fuse PTC Resettable Fuse. Spark Fun Electronics SKU : COM-08357
FTDI JP31 = jumper:JP2Q: JUMPER
IC1 = ftdichip:FT232R: Source: http://www.ftdichip.com/Documents/DataSheets/DS_FT232R_v104.pdf; MPN: FT232RL; OC_FARNELL: 1146032; OC_NEWARK: 91K9918
IC2 = linear:79*: Negative VOLTAGE REGULATOR
IC3-IC10 = linear:TL084: OP AMP
IC13 = linear:78*: Positive VOLTAGE REGULATOR Source: http://cache.national.com/ds/LM/LM78L05.pdf http://www.fairchildsemi.com/ds/LM/LM7805.pdf
JP1 = pinhead:PINHD-1X1: PIN HEADER
JP2-JP4 = pinhead:PINHD-1X2: PIN HEADER
JP5 JP7 JP12 JP13 JP16-JP23 JP30 JP32-JP54 = jumper:JP1Q: JUMPER
JP6 JP8-JP11 JP14 JP24-JP29 = pinhead:PINHD-1X3: PIN HEADER
JP15 = pinhead:PINHD-1X4: PIN HEADER
JP56 = pinhead:PINHD-2X3: PIN HEADER
L1 L3 = rcl:L-US: INDUCTOR, American symbol
LED1 LED2 LED5 LED6 RXLED TXLED = led:LED: LED OSRAM: - CHIPLED LG R971, LG N971, LY N971, LG Q971, LY Q971, LO R971, LY R971 LH N974, LH R974 LS Q976, LO Q976, LY Q976 LO Q996 - Hyper CHIPLED LW Q18S LB Q993, LB Q99A, LB R99A - SideLED LS A670, LO A670, LY A670, LG A670, LP A670 LB A673, LV A673, LT A673, LW A673 LH A674 LY A675 LS A676, LA A676, LO A676, LY A676, LW A676 LS A679, LY A679, LG A679 - Hyper Micro SIDELED® LS Y876, LA Y876, LO Y876, LY Y876 LT Y87S - SmartLED LW L88C, LW L88S LB L89C, LB L89S, LG L890 LS L89K, LO L89K, LY L89K LS L896, LA L896, LO L896, LY L896 - TOPLED LS T670, LO T670, LY T670, LG T670, LP T670 LSG T670, LSP T670, LSY T670, LOP T670, LYG T670 LG T671, LOG T671, LSG T671 LB T673, LV T673, LT T673, LW T673 LH T674 LS T676, LA T676, LO T676, LY T676, LB T676, LH T676, LSB T676, LW T676 LB T67C, LV T67C, LT T67C, LS T67K, LO T67K, LY T67K, LW E67C LS E67B, LA E67B, LO E67B, LY E67B, LB E67C, LV E67C, LT E67C LW T67C LS T679, LY T679, LG T679 LS T770, LO T770, LY T770, LG T770, LP T770 LB T773, LV T773, LT T773, LW T773 LH T774 LS E675, LA E675, LY E675, LS T675 LS T776, LA T776, LO T776, LY T776, LB T776 LHGB T686 LT T68C, LB T68C - Hyper Mini TOPLED® LB M676 - Mini TOPLED Santana® LG M470 LS M47K, LO M47K, LY M47K Source: http://www.osram.convergy.de LUXEON: - LUMILED® LXK2-PW12-R00, LXK2-PW12-S00, LXK2-PW14-U00, LXK2-PW14-V00 LXK2-PM12-R00, LXK2-PM12-S00, LXK2-PM14-U00 LXK2-PE12-Q00, LXK2-PE12-R00, LXK2-PE12-S00, LXK2-PE14-T00, LXK2-PE14-U00 LXK2-PB12-K00, LXK2-PB12-L00, LXK2-PB12-M00, LXK2-PB14-N00, LXK2-PB14-P00, LXK2-PB14-Q00 LXK2-PR12-L00, LXK2-PR12-M00, LXK2-PR14-Q00, LXK2-PR14-R00 LXK2-PD12-Q00, LXK2-PD12-R00, LXK2-PD12-S00 LXK2-PH12-R00, LXK2-PH12-S00 LXK2-PL12-P00, LXK2-PL12-Q00, LXK2-PL12-R00 Source: www.luxeon.com KINGBRIGHT: KA-3528ASYC Source: www.kingbright.com
Q1 = crystal:CRYSTAL: CRYSTAL; OC_FARNELL: 1667008; OC_NEWARK: unknown
Q2 = transistor-pnp:BC557*: PNP Transistror
R1-R13 R110 R111 R113 R118-R122 = resistor:R-US_: RESISTOR, American symbol
R14-R105 R107-R109 R112 R114-R117 R123-R125 R127 R129 R131 R133 R135 R137 = rcl:R-US_: RESISTOR, American symbol
S1 = switch-dil:DIP03YL: DIL/CODE SWITCH; OC_FARNELL: unknown; OC_NEWARK: unknown
S2 = switch-omron:10-XX: OMRON SWITCH; MPN: B3F-1000; OC_FARNELL: 176432; OC_NEWARK: 36M3542
SV1 = con-lstb:MA07-2: PIN HEADER; OC_FARNELL: unknown; OC_NEWARK: unknown
T1 T2 = transistor-neu-to92:BC547: NPN TRANSISTOR
U1 = uP:TMS320F28069_PN_80; MANUFACTURER_PART_NUMBER: tms320f28069_pn_80; VENDOR: Texas Instruments
U2 = TLV5610:TLV5610_PW_20; MANUFACTURER_PART_NUMBER: tlv5610_pw_20; VENDOR: Texas Instruments
U3 = ref2030:REF2030AIDDCR
U5 U6 = Texas Instruments_By_element14_Batch_1:TS12A44514DR: QUAD SPST CMOS ANALOG SWITCHES; MPN: TS12A44514DR; OC_FARNELL: 1755398; OC_NEWARK: 95M0176; PACKAGE: SOIC-14; SUPPLIER: Texas Instruments
U7 = Texas Instruments_By_element14_Batch_1:TPS7333QD: LOW-DROPOUT VOLTAGE REGULATORS; MPN: TPS7333QD; OC_FARNELL: -; OC_NEWARK: 52F2803; PACKAGE: SOIC-8; SUPPLIER: Texas Instruments
U9 = MAX395:MAX395CWG+; MANUFACTURER_PART_NUMBER: MAX395CWG+; VENDOR: Maxim Integrated Products

## Net classes
1 power: width 0.254 mm

## Board
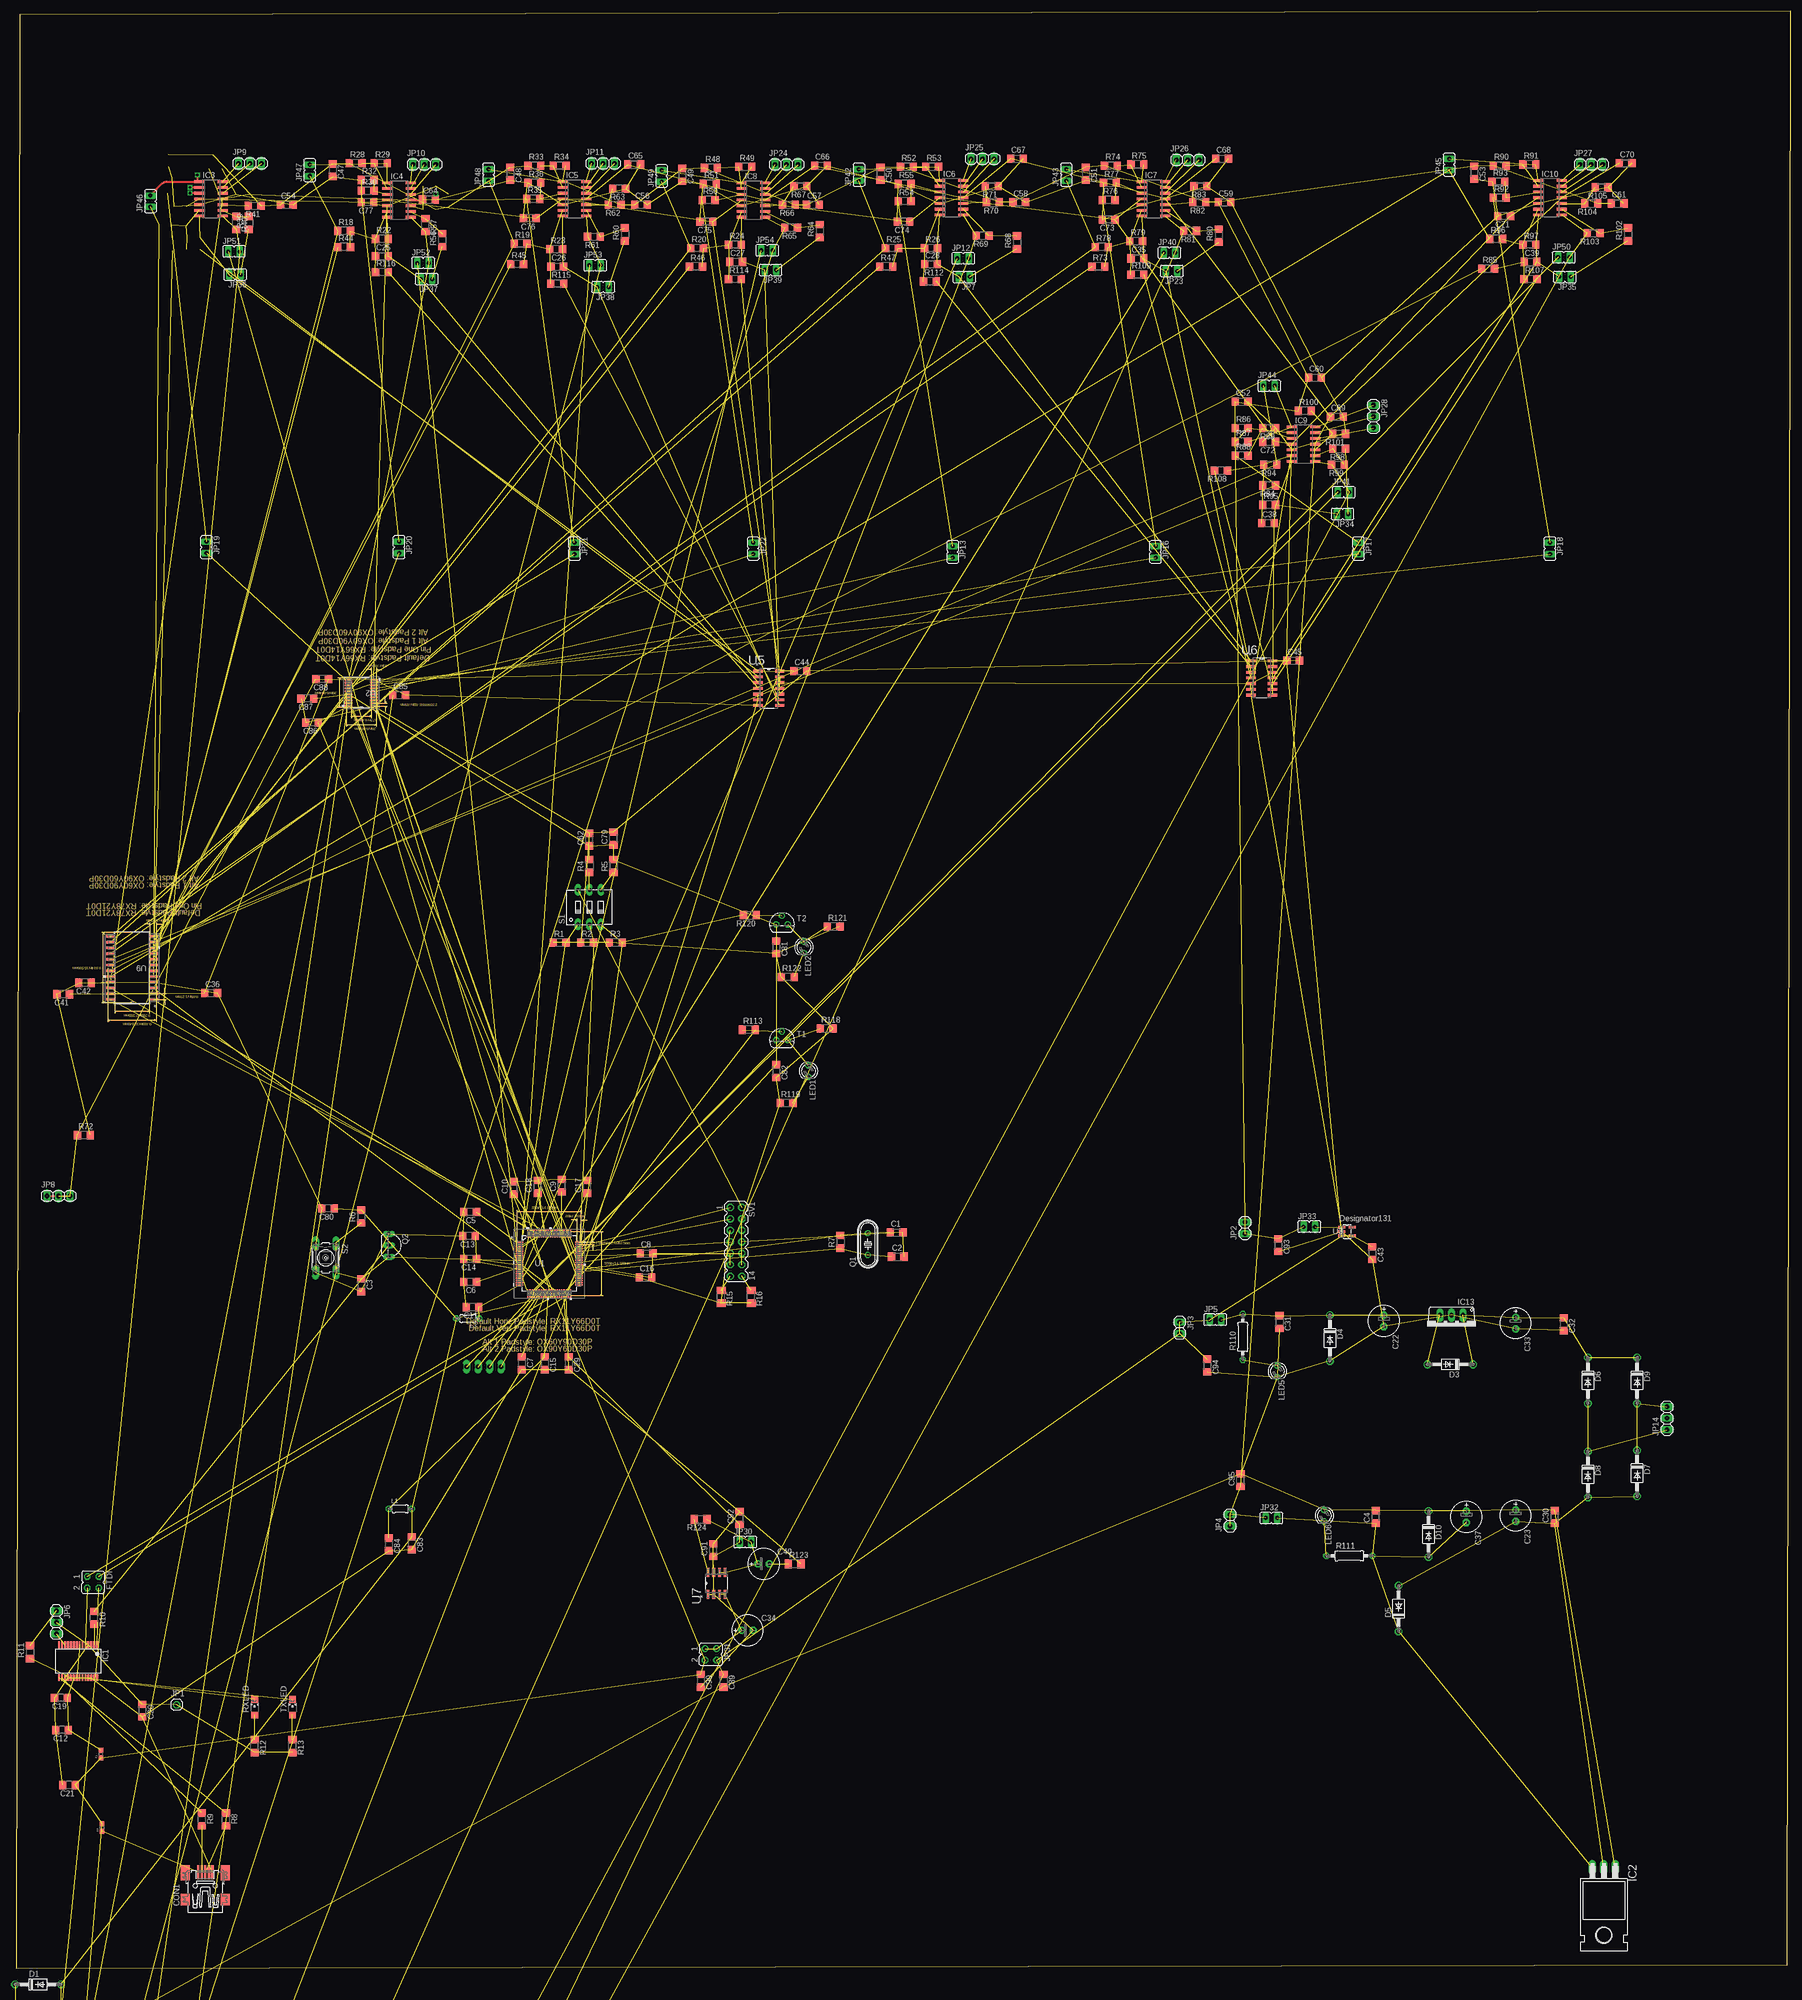
[diagram p2: board, top side]
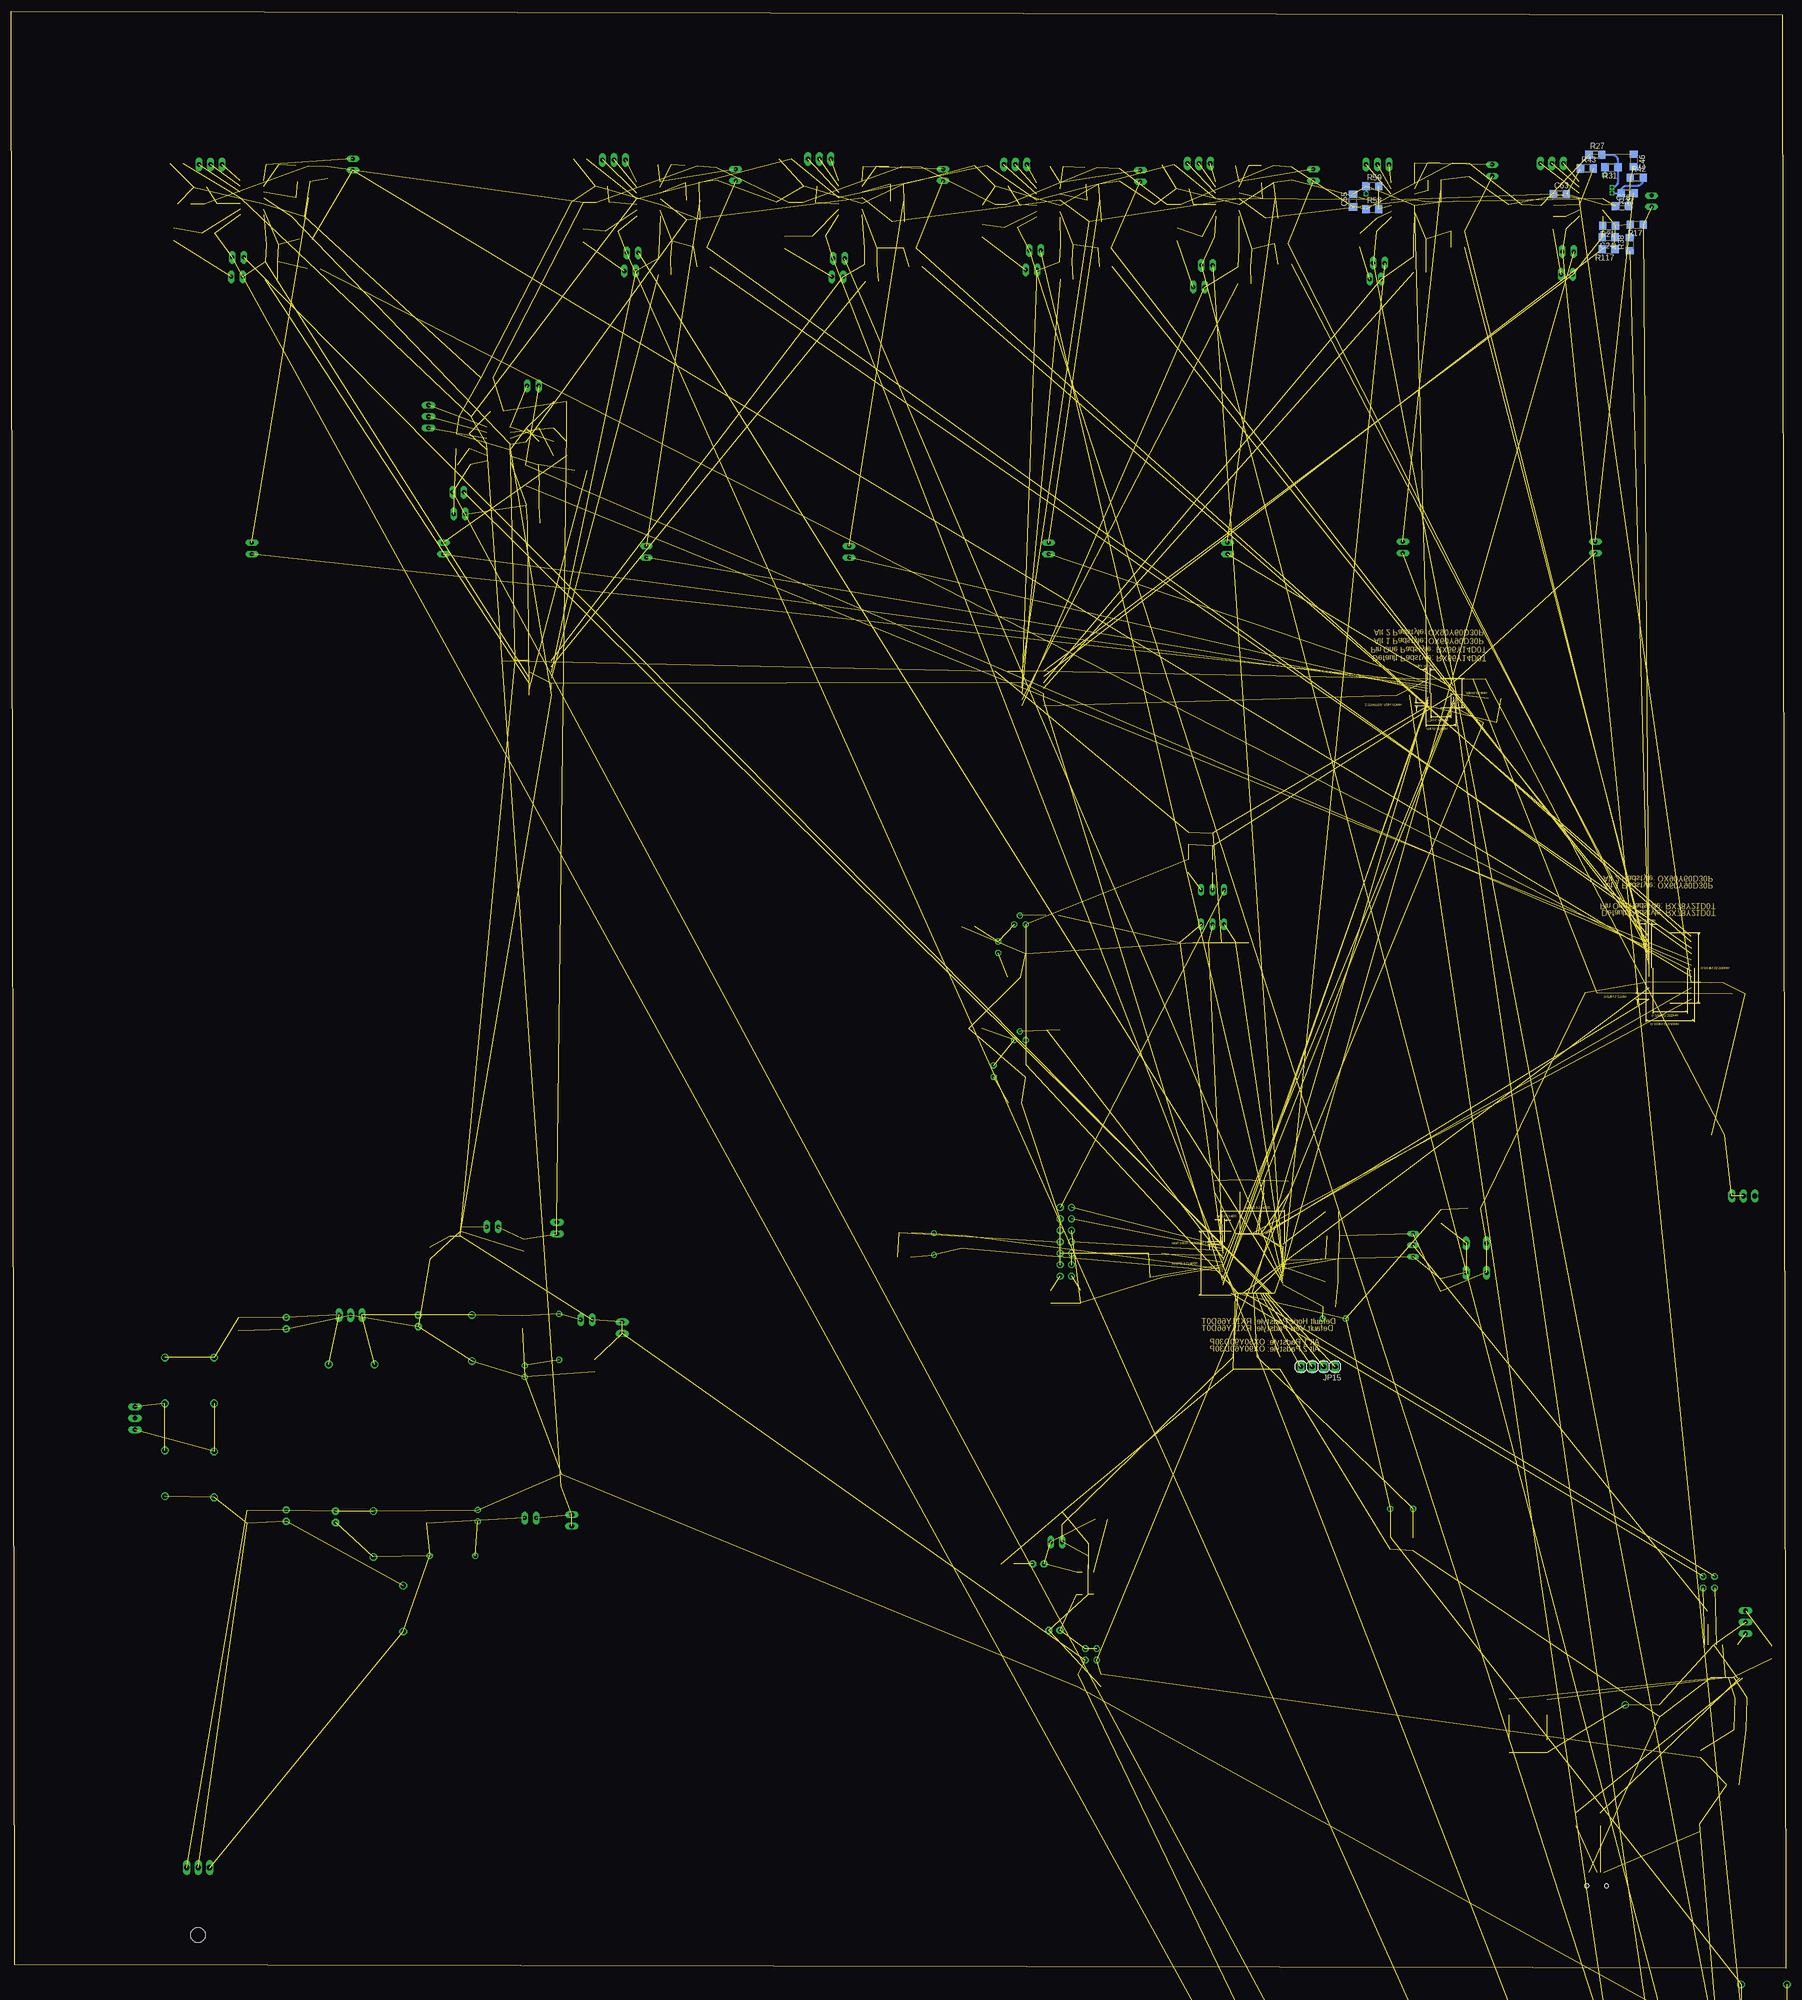
[diagram p3: board, bottom side, seen from below]

Size 393.17 x 433.76 mm. Coordinates in mm from the lower left corner, seen from the top.
Outline: 0,0 392.41,0.76 393.17,433.76 0.76,432.99 0,0
Copper layers (1*16): Top 0.035mm / dielectric 1.5mm / Bottom 0.035mm
Design rules "default *": minimum track width 8mil, minimum drill 24mil, track to track 7mil, track to pad 7mil, pad to pad 7mil, via to via 7mil, smd to smd 7mil, copper to edge 10mil, drill to drill 80mil, minimum pad ring 10mil, minimum via ring 8mil, stop-mask expansion 4mil, vias tented up to drill 0mil, thermal gap 10mil

### Footprints (pad centres in the part's own frame; a part is rotated, then mirrored left to right if it is on the bottom)
C1206 = smd 1.6 x 1.8: 1 -1.4,0; 2 1.4,0
E2,5-7 = drill 0.813 pad 1.6: + -1.27,0 | drill 0.813 pad 1.6 octagon: - 1.27,0
32005-201 = smd 3.1 x 0.5: 1 3,1.6; 2 3,0.8; 3 3,0; 4 3,-0.8; 5 3,-1.6 | smd 2.5 x 2: M1 -3,-4.45; M2 -3,4.45 | smd 3.3 x 2: M3 2.9,4.45; M4 2.9,-4.45 | hole 0.9: 0,2.2; 0,-2.2
DO41-10 = drill 1.118: A 5.08,0; C -5.08,0
0603 = smd 1.1 x 1: 1 -0.85,0; 2 0.85,0
JP2Q = drill 0.914 octagon: 1 -1.27,-1.27; 2 1.27,-1.27; 3 -1.27,1.27; 4 1.27,1.27
SSOP28 = smd 0.4 x 1.5: 1 -4.225,-3.625; 2 -3.575,-3.625; 3 -2.925,-3.625; 4 -2.275,-3.625; 5 -1.625,-3.625; 6 -0.975,-3.625; 7 -0.325,-3.625; 8 0.325,-3.625; 9 0.975,-3.625; 10 1.625,-3.625; 11 2.275,-3.625; 12 2.925,-3.625; 13 3.575,-3.625; 14 4.225,-3.625; 15 4.225,3.625; 16 3.575,3.625; 17 2.925,3.625; 18 2.275,3.625; 19 1.625,3.625; 20 0.975,3.625; 21 0.325,3.625; 22 -0.325,3.625; 23 -0.975,3.625; 24 -1.625,3.625; 25 -2.275,3.625; 26 -2.925,3.625; 27 -3.575,3.625; 28 -4.225,3.625
TO220H = drill 1.118 long: 1 -2.54,-10.16; 2 0,-10.16; 3 2.54,-10.16 | hole 3.302: 0,4.826
SO14 = smd 0.6 x 2.2: 1 -3.81,-2.6; 2 -2.54,-2.6; 3 -1.27,-2.6; 4 0,-2.6; 5 1.27,-2.6; 6 2.54,-2.6; 7 3.81,-2.6; 8 3.81,2.6; 9 2.54,2.6; 10 1.27,2.6; 11 0,2.6; 12 -1.27,2.6; 13 -2.54,2.6; 14 -3.81,2.6
TO220V = drill 1.016 long: 1 -2.54,-2.54; 2 0,-2.54; 3 2.54,-2.54
1X01 = drill 1.016 octagon: 1 0,0
1X02 = drill 1.016 long: 1 -1.27,0; 2 1.27,0
JP1 = drill 0.914 long: 1 0,-1.27; 2 0,1.27
1X03 = drill 1.016 long: 1 -2.54,0; 2 0,0; 3 2.54,0
1X04 = drill 1.016 long: 1 -3.81,0; 2 -1.27,0; 3 1.27,0; 4 3.81,0
2X03 = drill 1.016 octagon: 1 -2.54,-1.27; 2 -2.54,1.27; 3 0,-1.27; 4 0,1.27; 5 2.54,-1.27; 6 2.54,1.27
0204/5 = drill 0.813 octagon: 1 -2.54,0; 2 2.54,0
LED3MM = drill 0.813 octagon: A -1.27,0; K 1.27,0
HC49/S = drill 0.813: 1 -2.413,0; 2 2.413,0
TO92-EBC = drill 0.813 long: B 0,-1.27; C -2.54,-1.27; E 2.54,-1.27
R1206 = smd 1.6 x 1.803: 1 -1.422,0; 2 1.422,0
M1206 = smd 1.6 x 2: 1 -1.4,0; 2 1.4,0
0207/10 = drill 0.813 octagon: 1 -5.08,0; 2 5.08,0
CHIPLED_1206 = smd 1.5 x 1.5: A 0,-1.75; C 0,1.75
DIP03YL = drill 0.813 long: 1 -2.54,-3.81; 2 0,-3.81; 3 2.54,-3.81; 4 2.54,3.81; 5 0,3.81; 6 -2.54,3.81
B3F-10XX = drill 1.016 long: 1 -3.251,2.261; 2 3.251,2.261; 3 -3.251,-2.261; 4 3.251,-2.261
MA07-2 = drill 1.016 octagon: 1 -7.62,-1.27; 2 -7.62,1.27; 3 -5.08,-1.27; 4 -5.08,1.27; 5 -2.54,-1.27; 6 -2.54,1.27; 7 0,-1.27; 8 0,1.27; 9 2.54,-1.27; 10 2.54,1.27; 11 5.08,-1.27; 12 5.08,1.27; 13 7.62,-1.27; 14 7.62,1.27
TO92 = drill 0.813 octagon: 1 1.27,0; 2 0,1.905; 3 -1.27,0
PN80 = smd 1.676 x 0.279: 1 -6.617,4.75; 2 -6.617,4.25; 3 -6.617,3.75; 4 -6.617,3.25; 5 -6.617,2.75; 6 -6.617,2.25; 7 -6.617,1.75; 8 -6.617,1.25; 9 -6.617,0.75; 10 -6.617,0.25; 11 -6.617,-0.25; 12 -6.617,-0.75; 13 -6.617,-1.25; 14 -6.617,-1.75; 15 -6.617,-2.25; 16 -6.617,-2.75; 17 -6.617,-3.25; 18 -6.617,-3.75; 19 -6.617,-4.25; 20 -6.617,-4.75; 41 6.617,-4.75; 42 6.617,-4.25; 43 6.617,-3.75; 44 6.617,-3.25; 45 6.617,-2.75; 46 6.617,-2.25; 47 6.617,-1.75; 48 6.617,-1.25; 49 6.617,-0.75; 50 6.617,-0.25; 51 6.617,0.25; 52 6.617,0.75; 53 6.617,1.25; 54 6.617,1.75; 55 6.617,2.25; 56 6.617,2.75; 57 6.617,3.25; 58 6.617,3.75; 59 6.617,4.25; 60 6.617,4.75 | smd 0.279 x 1.676: 21 -4.75,-6.617; 22 -4.25,-6.617; 23 -3.75,-6.617; 24 -3.25,-6.617; 25 -2.75,-6.617; 26 -2.25,-6.617; 27 -1.75,-6.617; 28 -1.25,-6.617; 29 -0.75,-6.617; 30 -0.25,-6.617; 31 0.25,-6.617; 32 0.75,-6.617; 33 1.25,-6.617; 34 1.75,-6.617; 35 2.25,-6.617; 36 2.75,-6.617; 37 3.25,-6.617; 38 3.75,-6.617; 39 4.25,-6.617; 40 4.75,-6.617; 61 4.75,6.617; 62 4.25,6.617; 63 3.75,6.617; 64 3.25,6.617; 65 2.75,6.617; 66 2.25,6.617; 67 1.75,6.617; 68 1.25,6.617; 69 0.75,6.617; 70 0.25,6.617; 71 -0.25,6.617; 72 -0.75,6.617; 73 -1.25,6.617; 74 -1.75,6.617; 75 -2.25,6.617; 76 -2.75,6.617; 77 -3.25,6.617; 78 -3.75,6.617; 79 -4.25,6.617; 80 -4.75,6.617
PW20 = smd 1.676 x 0.356: 1 -2.819,2.925; 2 -2.819,2.275; 3 -2.819,1.625; 4 -2.819,0.975; 5 -2.819,0.325; 6 -2.819,-0.325; 7 -2.819,-0.975; 8 -2.819,-1.625; 9 -2.819,-2.275; 10 -2.819,-2.925; 11 2.819,-2.925; 12 2.819,-2.275; 13 2.819,-1.625; 14 2.819,-0.975; 15 2.819,-0.325; 16 2.819,0.325; 17 2.819,0.975; 18 2.819,1.625; 19 2.819,2.275; 20 2.819,2.925
DDC0005A_N = smd 1.575 x 0.559: 1 -1.168,0.95; 2 -1.168,0; 3 -1.168,-0.95; 4 1.168,-0.95; 5 1.168,0.95
SOIC127P600X175-14N = smd 2.057 x 0.61: 1 -4.801,7.62; 2 -4.801,6.35; 3 -4.801,5.08; 4 -4.801,3.81; 5 -4.801,2.54; 6 -4.801,1.27; 7 -4.801,0; 8 0,0; 9 0,1.27; 10 0,2.54; 11 0,3.81; 12 0,5.08; 13 0,6.35; 14 0,7.62
SOIC127P600X175-8N = smd 1.981 x 0.559: 1 -2.464,1.905; 2 -2.464,0.635; 3 -2.464,-0.635; 4 -2.464,-1.905; 5 2.464,-1.905; 6 2.464,-0.635; 7 2.464,0.635; 8 2.464,1.905
21-0042B_24 = smd 1.981 x 0.533: 1 -4.686,6.985; 2 -4.686,5.715; 3 -4.686,4.445; 4 -4.686,3.175; 5 -4.686,1.905; 6 -4.686,0.635; 7 -4.686,-0.635; 8 -4.686,-1.905; 9 -4.686,-3.175; 10 -4.686,-4.445; 11 -4.686,-5.715; 12 -4.686,-6.985; 13 4.686,-6.985; 14 4.686,-5.715; 15 4.686,-4.445; 16 4.686,-3.175; 17 4.686,-1.905; 18 4.686,-0.635; 19 4.686,0.635; 20 4.686,1.905; 21 4.686,3.175; 22 4.686,4.445; 23 4.686,5.715; 24 4.686,6.985

### Placement (x,y rotation side)
C1  195.07,163.07 0 top
C2  195.33,157.73 0 top
C3  76.45,151.38 270 top
C4  301.24,100.08 90 top
C5  100.58,167.64 180 top
C6  100.58,152.15 180 top
C7  112.01,134.11 270 top
C8  139.7,158.5 0 top
C9  120.9,173.48 90 top
C10  110.24,172.97 90 top
C11  101.09,146.56 180 top
C12  10.16,52.83 180 top
C13  100.33,162.31 180 top
C14  100.58,157.23 180 top
C15  117.09,134.11 270 top
C16  139.45,153.16 0 top
C17  126.49,173.23 90 top
C18  115.57,173.23 90 top
C19  9.91,59.94 180 top
C20  27.94,57.15 270 top
C21  11.68,40.64 180 top
C22  303.02,143.51 270 top
C23  332.23,100.33 270 top
C24  39.24,383.67 180 bottom
C25  81.03,379.48 0 top
C26  119.89,377.19 0 top
C27  159.51,378.21 0 top
C28  202.69,377.7 0 top
C29  122.43,134.11 270 top
C30  340.87,100.08 90 top
C31  279.91,143.26 270 top
C32  342.9,142.75 270 top
C33  332.23,143 270 top
C34  162.05,74.93 0 top
C35  248.41,378.97 0 top
C36  43.18,216.15 0 top
C37  321.31,100.08 270 top
C38  277.37,320.29 0 top
C39  335.53,378.21 0 top
C40  165.61,89.66 0 top
C41  10.41,215.9 180 top
C42  15.24,218.44 180 top
C43  300.48,158.5 270 top
C44  173.74,287.53 0 top
C45  282.96,289.81 0 top
C46  33.66,400.69 270 bottom
C47  70.1,398.53 270 top
C48  109.47,397.76 270 top
C49  147.57,397.51 270 top
C50  191.52,397.76 270 top
C51  236.98,397.76 270 top
C52  271.53,347.22 0 top
C53  323.09,398.02 270 top
C54  59.94,390.91 0 top
C55  95.89,391.8 90 bottom
C56  138.43,390.91 0 top
C57  176.53,390.91 0 top
C58  222.25,391.41 0 top
C59  267.72,391.41 0 top
C60  287.78,352.55 0 top
C61  354.84,391.16 0 top
C62  127,250.19 90 top
C63  50.04,393.19 0 bottom
C64  91.44,392.05 0 top
C65  136.91,399.8 0 top
C66  178.31,399.54 0 top
C67  221.74,401.07 0 top
C68  267.21,401.07 0 top
C69  292.61,343.92 0 top
C70  356.62,400.05 0 top
C71  329.69,388.37 180 top
C72  277.62,338.33 180 top
C73  242.06,387.6 180 top
C74  196.6,387.1 180 top
C75  152.91,387.1 180 top
C76  113.79,387.86 180 top
C77  77.85,391.41 180 top
C78  36.32,390.52 0 bottom
C79  132.33,250.44 90 top
C80  69.09,168.4 180 top
C81  168.4,226.31 270 top
C82  168.4,198.88 270 top
C83  87.63,94.23 270 top
C84  82.55,93.98 270 top
C85  84.84,282.19 0 top
C86  65.53,276.1 180 top
C87  64.52,281.43 180 top
C88  67.82,285.75 180 top
C89  156.72,63.75 270 top
C90  151.64,63.75 270 top
C91  154.43,92.71 90 top
C92  160.27,99.82 90 top
C93  279.65,160.27 270 top
C94  263.91,133.6 270 top
C95  271.27,108.2 90 top
CON1  41.91,18.29 90 top
D1  4.83,-3.56 0 top  (outside the outline)
D2  4.83,-10.41 0 top  (outside the outline)
D3  317.75,133.86 180 top
D4  291.08,139.7 270 top
D5  306.32,79.76 90 top
D6  348.23,130.3 270 top
D7  359.16,109.73 270 top
D8  348.23,109.47 270 top
D9  359.16,130.3 270 top
D10  312.93,96.27 270 top
D11  4.83,-17.27 0 top  (outside the outline)
D12  4.83,-24.13 0 top  (outside the outline)
D13  4.83,-39.12 0 top  (outside the outline)
D14  4.83,-45.97 0 top  (outside the outline)
D15  4.83,-52.83 0 top  (outside the outline)
D16  4.83,-59.69 0 top  (outside the outline)
D17  4.83,-70.61 0 top  (outside the outline)
D18  4.83,-77.47 0 top  (outside the outline)
D19  4.83,-84.33 0 top  (outside the outline)
D20  4.83,-91.19 0 top  (outside the outline)
D21  4.83,-102.11 0 top  (outside the outline)
D22  4.83,-108.97 0 top  (outside the outline)
D23  4.83,-115.82 0 top  (outside the outline)
D24  4.83,-122.68 0 top  (outside the outline)
D25  4.83,-133.6 0 top  (outside the outline)
D26  4.83,-140.46 0 top  (outside the outline)
D27  4.83,-147.32 0 top  (outside the outline)
D28  4.83,-154.18 0 top  (outside the outline)
D29  4.83,-165.1 0 top  (outside the outline)
D30  4.83,-171.96 0 top  (outside the outline)
D31  4.83,-178.82 0 top  (outside the outline)
D32  4.83,-185.67 0 top  (outside the outline)
D33  4.83,-196.6 0 top  (outside the outline)
D34  4.83,-203.45 0 top  (outside the outline)
D35  4.83,-210.31 0 top  (outside the outline)
D36  4.83,-217.17 0 top  (outside the outline)
D37  4.83,-228.09 0 top  (outside the outline)
D38  4.83,-234.95 0 top  (outside the outline)
D39  4.83,-241.81 0 top  (outside the outline)
D40  4.83,-252.73 0 top  (outside the outline)
F1  18.8,47.5 90 top
F3  19.05,31.24 90 top
FTDI  17.02,85.6 270 top
IC1  13.72,68.07 180 top
IC2  351.79,12.19 180 top
IC3  43.18,392.18 270 top
IC4  84.84,391.92 270 top
IC5  123.7,392.18 270 top
IC6  207.26,392.43 270 top
IC7  251.97,392.18 270 top
IC8  163.32,391.92 270 top
IC9  285.24,337.82 270 top
IC10  339.85,392.43 270 top
IC13  318.01,142.24 180 top
JP1  35.56,58.42 0 top
JP2  272.29,164.08 90 top
JP3  257.81,141.99 270 top
JP4  268.99,99.31 90 top
JP5  265.68,143.76 270 top
JP6  8.89,76.71 270 top
JP7  210.06,374.9 90 top
JP8  9.4,171.2 0 top
JP9  51.82,400.05 0 top
JP10  90.42,399.8 0 top
JP11  130.05,400.05 0 top
JP12  209.8,378.97 270 top
JP13  207.52,313.94 180 top
JP14  365.76,121.92 90 top
JP15  103.63,133.35 180 bottom
JP16  252.48,313.94 180 top
JP17  297.43,314.71 180 top
JP18  339.85,314.71 180 top
JP19  42.16,314.96 180 top
JP20  84.84,314.96 180 top
JP21  123.7,314.71 180 top
JP22  163.32,314.71 180 top
JP23  256.03,376.17 90 top
JP24  170.69,399.8 0 top
JP25  214.12,401.07 0 top
JP26  259.59,400.81 0 top
JP27  349,399.8 0 top
JP28  300.74,343.92 270 top
JP29  3.05,-259.59 0 top  (outside the outline)
JP30  161.54,94.49 270 top
JP31  153.92,69.6 270 top
JP32  278.13,99.82 270 top
JP33  286.51,164.34 270 top
JP34  293.88,322.33 90 top
JP35  343.15,374.9 90 top
JP36  48.51,375.41 90 top
JP37  90.93,374.4 90 top
JP38  130.05,372.62 90 top
JP39  167.13,376.43 90 top
JP40  255.52,380.24 270 top
JP41  294.13,327.15 270 top
JP42  186.69,397.51 0 top
JP43  232.66,397.51 0 top
JP44  277.62,350.77 270 top
JP45  317.5,399.8 0 top
JP46  29.72,391.67 0 top
JP47  65.02,398.53 0 top
JP48  104.65,397.51 0 top
JP49  143,397.26 0 top
JP50  342.9,379.22 270 top
JP51  48.26,380.49 270 top
JP52  90.17,377.95 270 top
JP53  128.27,377.44 270 top
JP54  166.37,380.75 270 top
JP56  -5.59,-256.54 0 top  (outside the outline)
L1  85.09,101.85 0 top
L3  100.08,144.02 180 top
LED1  175.51,198.88 270 top
LED2  174.5,226.31 270 top
LED5  279.4,132.33 270 top
LED6  289.81,100.33 270 top
Q1  188.72,160.53 90 top
Q2  83.82,160.27 270 top
R1  120.4,227.33 0 top
R2  126.49,227.33 0 top
R3  132.84,227.33 0 top
R4  127,244.35 90 top
R5  132.33,244.35 90 top
R6  76.45,166.62 90 top
R7  182.63,161.04 90 top
R8  46.48,33.02 270 top
R9  41.15,33.02 270 top
R10  17.27,77.72 270 top
R11  3.05,70.1 90 top
R12  52.83,49.28 270 top
R13  61.21,49.28 270 top
R14  1.02,-30.48 0 top  (outside the outline)
R15  156.21,148.84 270 top
R16  162.81,148.84 270 top
R17  33.02,386.46 180 bottom
R18  72.64,385.06 0 top
R19  111.76,382.27 0 top
R20  150.88,381.25 0 top
R21  39.12,386.21 180 bottom
R22  81.03,383.29 0 top
R23  119.63,381 0 top
R24  159.26,382.02 0 top
R25  194.06,381.25 0 top
R26  202.69,381.25 0 top
R27  42.16,401.95 0 bottom
R28  75.18,400.05 0 top
R29  80.77,400.05 0 top
R30  77.85,393.95 0 top
R31  38.61,399.16 180 bottom
R32  77.85,396.37 0 top
R33  114.81,399.54 0 top
R34  120.4,399.54 0 top
R35  114.55,392.18 0 top
R36  114.81,395.73 0 top
R37  35.05,393.45 180 bottom
R38  34.54,382.14 90 bottom
R39  51.56,386.84 90 top
R40  48.77,386.84 270 top
R41  52.83,390.65 180 top
R42  33.02,396.88 0 bottom
R43  44.07,398.91 0 bottom
R44  72.64,381.51 0 top
R45  111,377.7 0 top
R46  150.62,377.19 0 top
R47  192.79,377.19 0 top
R48  153.92,399.03 0 top
R49  161.54,399.29 0 top
R50  153.42,391.92 0 top
R51  153.67,395.48 0 top
R52  197.36,399.29 0 top
R53  202.95,399.29 0 top
R54  196.85,391.67 0 top
R55  196.85,395.48 0 top
R56  94.36,383.03 90 top
R57  90.68,386.33 270 top
R58  91.57,389.89 0 bottom
R59  91.57,394.97 0 bottom
R60  134.87,384.3 90 top
R61  128.02,383.79 180 top
R62  132.59,390.91 180 top
R63  133.6,394.46 180 top
R64  178.05,385.06 90 top
R65  171.7,385.83 180 top
R66  171.2,390.91 180 top
R67  173.74,394.97 180 top
R68  221.74,382.52 90 top
R69  214.12,384.05 180 top
R70  216.41,391.41 180 top
R71  216.15,394.97 180 top
R72  14.99,184.66 0 top
R73  239.78,377.19 0 top
R74  242.57,399.54 0 top
R75  248.41,399.8 0 top
R76  242.06,391.92 0 top
R77  242.32,395.73 0 top
R78  240.54,381.51 0 top
R79  248.16,382.78 0 top
R80  266.45,384.05 90 top
R81  260.1,385.06 180 top
R82  262.13,391.41 180 top
R83  262.38,394.97 180 top
R84  277.62,328.68 180 top
R85  326.14,376.68 0 top
R86  271.53,341.38 0 top
R87  271.53,338.33 0 top
R88  271.53,335.28 0 top
R89  277.62,341.38 180 top
R90  328.68,399.54 0 top
R91  335.28,399.8 0 top
R92  328.68,392.43 0 top
R93  328.42,395.99 0 top
R94  277.88,333.25 180 top
R95  277.62,324.36 0 top
R96  327.91,383.29 0 top
R97  335.28,382.02 0 top
R98  293.12,336.8 180 top
R99  292.86,333.25 180 top
R100  285.5,345.19 0 top
R101  293.12,340.11 180 top
R102  357.12,384.3 90 top
R103  349.5,384.56 180 top
R104  349,391.16 180 top
R105  351.28,394.72 180 top
R107  335.53,374.4 0 top
R108  266.95,331.98 180 top
R109  248.41,375.41 0 top
R110  271.78,139.95 90 top
R111  295.4,91.44 0 top
R112  202.44,373.89 0 top
R113  162.31,208.03 0 top
R114  159.26,374.4 0 top
R115  119.89,373.38 0 top
R116  81.03,375.92 0 top
R117  39.24,381 180 bottom
R118  179.58,208.28 0 top
R119  170.69,191.77 0 top
R120  162.56,233.43 180 top
R121  181.1,230.89 0 top
R122  170.94,219.71 0 top
R123  172.47,89.66 0 top
R124  151.64,99.57 180 top
R125  13.46,-59.18 0 top  (outside the outline)
R127  13.46,-90.68 0 top  (outside the outline)
R129  13.46,-122.17 0 top  (outside the outline)
R131  13.46,-153.67 0 top  (outside the outline)
R133  13.46,-185.17 0 top  (outside the outline)
R135  13.46,-216.66 0 top  (outside the outline)
R137  1.02,-248.16 0 top  (outside the outline)
RXLED  52.83,57.91 0 top
S1  127,235.2 0 top
S2  68.58,157.48 270 top
SV1  159.51,161.04 270 top
T1  169.67,205.74 0 top
T2  169.67,231.39 0 top
TXLED  61.21,57.91 0 top
U1  118.11,156.21 0 top
U2  76.45,282.7 180 top
U3  294.89,163.32 0 top
U5  169.16,279.91 0 top
U6  278.38,282.19 0 top
U7  155.19,85.34 90 top
U9  25.65,221.74 180 top

### Tracks (layer width: path | path; a pad name or v marks a point on that pad's centre or on a via)
3V3_OUT  (6 unrouted)
+1.5V  (35 unrouted)
  Top 0.406: 69.97,399.93 C47.1
+3V3  (28 unrouted)
+5V  (36 unrouted)
-5V  (20 unrouted)
  Top 0.406: IC4.11 89.91,391.92 arc90 C64.1
????????????????????????????  (1 unrouted)
ADCINA0  (1 unrouted)
ADCINA1  (1 unrouted)
ADCINA2  (1 unrouted)
ADCINA4  (1 unrouted)
ADCINA5  (1 unrouted)
ADCINA6  (1 unrouted)
ADCINB0  (1 unrouted)
ADCINB1  (1 unrouted)
ADCINB2  (1 unrouted)
ADCINB4  (1 unrouted)
ADCINB5  (1 unrouted)
ADCINB6  (1 unrouted)
AGND  (via drill 0.6)  (91 unrouted)
  Top 0.406: JP8.1 JP8.3 | v92.96,393.32 92.96,392.17 arc-90 C64.2
  Bottom 0.406: R59.1 92.99,393.34 arc-90 v92.96,393.32
CBUS4  (1 unrouted)
D+  (1 unrouted)
D-  (1 unrouted)
DACDIN  (1 unrouted)
DACDOUT  (1 unrouted)
DACO1  (1 unrouted)
DACO2  (1 unrouted)
DACO3  (1 unrouted)
DACO4  (1 unrouted)
DACO5  (1 unrouted)
DACO6  (1 unrouted)
DACO7  (1 unrouted)
DACO8  (1 unrouted)
DTR_RESET  (1 unrouted)
FS  (1 unrouted)
GND  (73 unrouted)
GPIO34  (3 unrouted)
IDK  (6 unrouted)
IDK2  (6 unrouted)
IN1  (1 unrouted)
IN2  (1 unrouted)
IN3  (1 unrouted)
IN4  (1 unrouted)
IN5  (1 unrouted)
IN6  (1 unrouted)
IN7  (1 unrouted)
IN8  (1 unrouted)
INT_CONTROL  (8 unrouted)
INTINP1  (2 unrouted)
INTINP2  (2 unrouted)
INTINP3  (2 unrouted)
INTINP4  (2 unrouted)
INTINP5  (2 unrouted)
INTINP6  (2 unrouted)
INTINP7  (2 unrouted)
INTINP8  (2 unrouted)
INTSWITCH1  (1 unrouted)
INTSWITCH2  (1 unrouted)
INTSWITCH3  (1 unrouted)
INTSWITCH4  (1 unrouted)
INTSWITCH5  (1 unrouted)
INTSWITCH6  (1 unrouted)
INTSWITCH7  (1 unrouted)
INTSWITCH8  (1 unrouted)
JTAG_TRST  (1 unrouted)
LDACBAR  (1 unrouted)
LED1  (1 unrouted)
N$1  (1 unrouted)
N$2  (1 unrouted)
N$3  (1 unrouted)
N$4  (1 unrouted)
N$5  (1 unrouted)
N$6  (1 unrouted)
N$7  (2 unrouted)
N$8  (1 unrouted)
N$9  (1 unrouted)
N$10  (1 unrouted)
N$11  (1 unrouted)
N$12  (1 unrouted)
N$13  (1 unrouted)
N$14  (1 unrouted)
N$15  (1 unrouted)
N$16  (1 unrouted)
N$17  (1 unrouted)
N$20  (5 unrouted)
N$21  (5 unrouted)
N$22  (5 unrouted)
N$23  (2 unrouted)
N$24  (1 unrouted)
N$25  (1 unrouted)
N$26  (2 unrouted)
N$28  (5 unrouted)
N$29  (via drill 0.6)
  Top 0.406: v38.48,394.72 IC3.2
  Bottom 0.406: R27.2 38.48,401.95 arc90 37.21,400.69 R31.1 37.19,396.01 arc90 v38.48,394.72
N$30  (5 unrouted)
N$31  (2 unrouted)
N$33  (via drill 0.6)
  Top 0.406: IC3.3 v38.48,393.45
  Bottom 0.406: v38.48,393.45 R37.2 36.47,393.83 arc90 35.2,395.1 32.87,395.1 arc-90 31.6,396.37 R42.2
N$35  (2 unrouted)
N$36  (2 unrouted)
N$38  (2 unrouted)
N$39  (2 unrouted)
N$40  (2 unrouted)
N$41  (2 unrouted)
N$42  (2 unrouted)
N$43  (2 unrouted)
N$44  (2 unrouted)
N$45  (2 unrouted)
N$46  (1 unrouted)
N$47  (2 unrouted)
N$48  (2 unrouted)
N$49  (2 unrouted)
N$50  (2 unrouted)
N$51  (2 unrouted)
N$52  (2 unrouted)
N$53  (2 unrouted)
N$54  (2 unrouted)
N$55  (5 unrouted)
N$56  (2 unrouted)
N$57  (2 unrouted)
N$58  (2 unrouted)
N$59  (2 unrouted)
N$60  (2 unrouted)
N$61  (2 unrouted)
N$62  (5 unrouted)
N$63  (5 unrouted)
N$64  (2 unrouted)
N$65  (2 unrouted)
N$66  (2 unrouted)
N$67  (2 unrouted)
N$70  (1 unrouted)
N$71  (1 unrouted)
N$72  (1 unrouted)
N$73  (5 unrouted)
N$74  (1 unrouted)
N$75  (1 unrouted)
N$76  (1 unrouted)
N$77  (4 unrouted)
N$78  (1 unrouted)
N$80  (1 unrouted)
N$81  (4 unrouted)
N$82  (1 unrouted)
N$83  (1 unrouted)
N$85  (1 unrouted)
N$86  (5 unrouted)
N$87  (1 unrouted)
N$88  (1 unrouted)
N$89  (1 unrouted)
N$90  (1 unrouted)
N$91  (1 unrouted)
N$93  (1 unrouted)
N$95  (1 unrouted)
N$96  (1 unrouted)
N$97  (2 unrouted)
N$98  (1 unrouted)
N$100  (2 unrouted)
N$102  (1 unrouted)
N$104  (2 unrouted)
N$105  (1 unrouted)
N$106  (1 unrouted)
N$107  (2 unrouted)
N$108  (1 unrouted)
N$109  (1 unrouted)
N$110  (1 unrouted)
N$111  (1 unrouted)
N$112  (1 unrouted)
N$113  (1 unrouted)
N$114  (1 unrouted)
N$115  (1 unrouted)
N$116  (1 unrouted)
N$117  (1 unrouted)
N$118  (2 unrouted)
N$119  (2 unrouted)
N$120  (2 unrouted)
N$121  (2 unrouted)
N$122  (2 unrouted)
N$123  (2 unrouted)
N$124  (2 unrouted)
N$125  (2 unrouted)
N$126  (2 unrouted)
N$127  (2 unrouted)
N$128  (2 unrouted)
N$129  (2 unrouted)
N$130  (1 unrouted)
N$133  (1 unrouted)
OUT1  (4 unrouted)
OUT2  (4 unrouted)
OUT3  (4 unrouted)
OUT4  (4 unrouted)
OUT5  (4 unrouted)
OUT6  (4 unrouted)
OUT7  (4 unrouted)
OUT8  (4 unrouted)
PLS1  (1 unrouted)
PLS2  (1 unrouted)
PLS3  (1 unrouted)
PLS4  (1 unrouted)
PLS5  (1 unrouted)
PLS6  (1 unrouted)
PLS7  (1 unrouted)
PLS8  (1 unrouted)
RES  (1 unrouted)
RESET#  (5 unrouted)
RXD  (1 unrouted)
SPIBCLK  (1 unrouted)
SPIBMISO  (1 unrouted)
SPIBMOSI  (1 unrouted)
SPIBSS  (1 unrouted)
SPICLK  (1 unrouted)
SV1-1  (2 unrouted)
SV1-3  (2 unrouted)
SWITCH1  (1 unrouted)
SWITCH2  (1 unrouted)
SWITCH3  (1 unrouted)
SWITCH4  (1 unrouted)
SWITCH5  (1 unrouted)
SWITCH6  (1 unrouted)
SWITCH7  (1 unrouted)
SWITCH8  (1 unrouted)
TCK  (2 unrouted)
TDI  (1 unrouted)
TDO  (3 unrouted)
TMS  (1 unrouted)
TMS_RXD  (1 unrouted)
TMS_TXD  (1 unrouted)
TRST  (2 unrouted)
TXD  (1 unrouted)
USB_VCC  (8 unrouted)
VCC  (3 unrouted)
VDDIO  (16 unrouted)
X1  (4 unrouted)
X1CLK  (3 unrouted)
X1DOT  (via drill 0.6)
  Top 0.406: JP46.2 32.39,395.61 arc-45 33.29,395.99 IC3.1 arc-90 40.13,396.43 v40.13,397.51
  Bottom 0.406: R31.2 40.13,399.16 v40.13,397.51
X2  (4 unrouted)
X2CLK  (3 unrouted)
X2DOT  (2 unrouted)
X3  (4 unrouted)
X3DOT  (2 unrouted)
X4  (4 unrouted)
X4DOT  (2 unrouted)
X5  (4 unrouted)
X5DOT  (2 unrouted)
X6  (4 unrouted)
X6DOT  (2 unrouted)
X7  (4 unrouted)
X7DOT  (2 unrouted)
X8  (4 unrouted)
X8DOT  (2 unrouted)